# Altium project PropMark.PrjPcb (part 1 of 2)
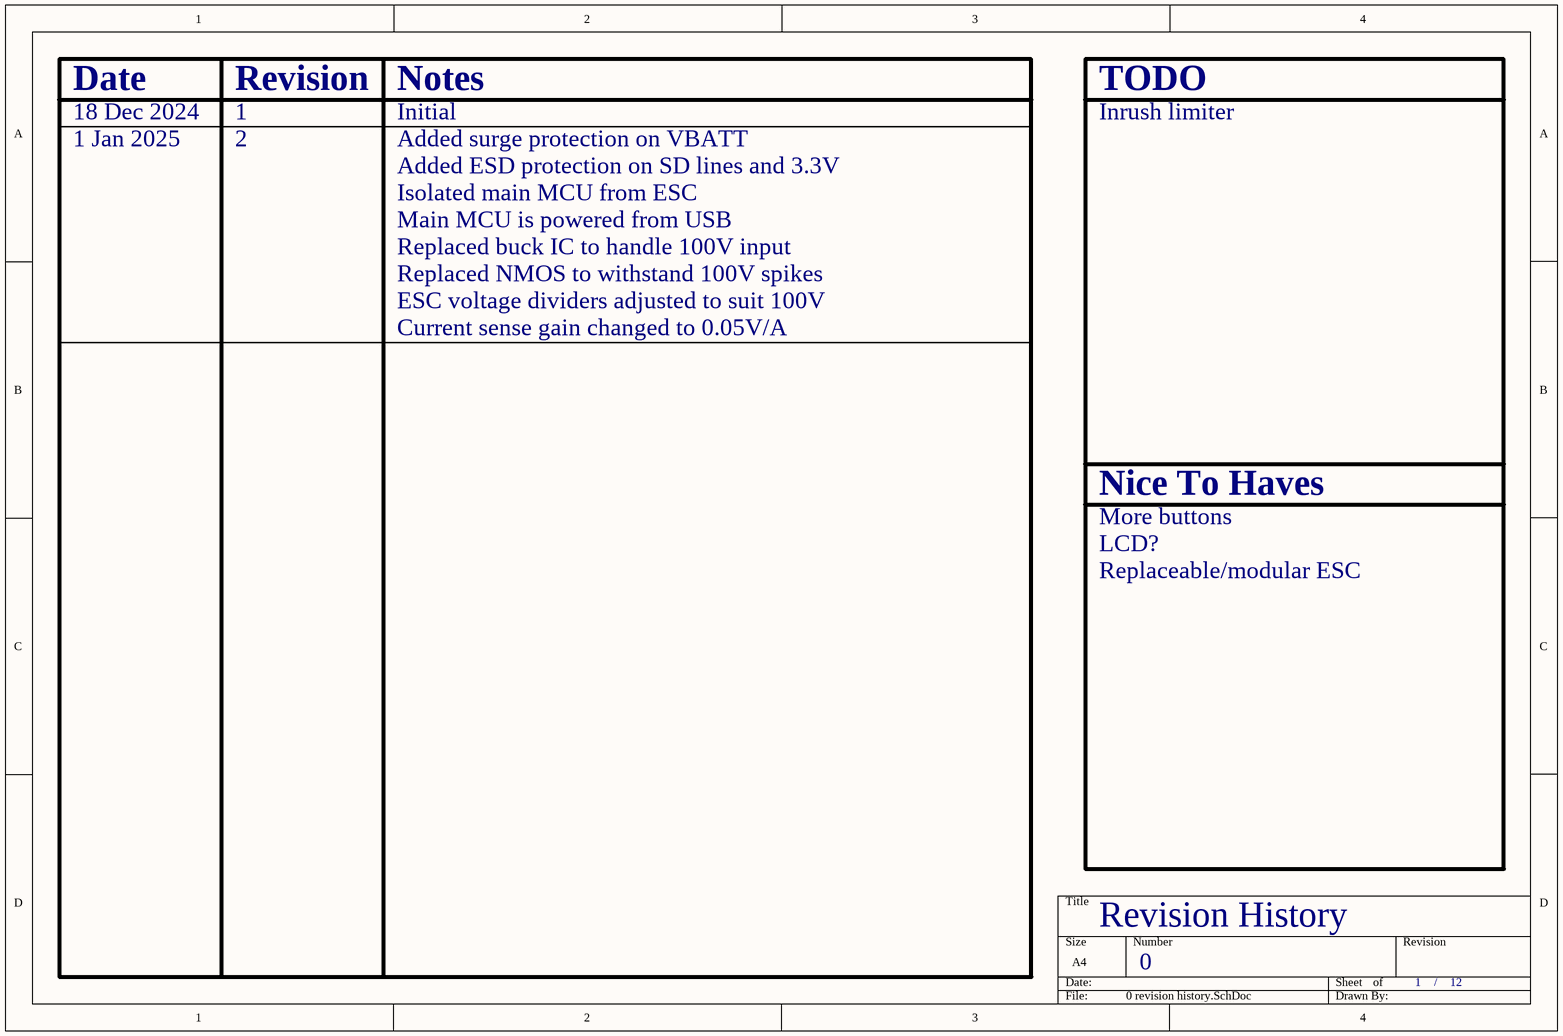
[diagram p0: 0 revision history.SchDoc]
12 sheets, 228 parts. Net scope: hierarchical (ports join the sheet entries above them; power ports are global).
Board files: main.PcbDoc, panel.PcbDoc
Sheets:
  0 revision history.SchDoc
  0 overview.SchDoc
    Power = 1 power.SchDoc
    MCU = 2 main mcu.SchDoc
    Ports = 3 ports.SchDoc
    Memory = 4 memory.SchDoc
    LED = 5 led.SchDoc
    Amplifiers1 = 6 cell amplifier.SchDoc
    Amplifiers2 = 6 cell amplifier.SchDoc
    Amplifiers3 = 6 cell amplifier.SchDoc
    Amplifiers4 = 6 cell amplifier.SchDoc
    Amplifiers5 = 6 cell amplifier.SchDoc
    Amplifiers6 = 6 cell amplifier.SchDoc
    ESC = 7 esc.SchDoc
      H Bridge = 9 h bridge.SchDoc
      Gate Driver = 8 gate driver.SchDoc
    Isolator = 10 isolator.SchDoc
    Isolator = 10 isolator.SchDoc
    Isolator = 10 isolator.SchDoc

## Sheet 0 revision history.SchDoc
size A4; DocumentNumber: 0; SheetNumber: 1; SheetTotal: 12

### Notes on the sheet
- Date
- Revision
- Notes
- TODO
- 18 Dec 2024
- 1 Jan 2025
- 1
- 2
- Initial
- Added surge protection on VBATT
- Added ESD protection on SD lines and 3.3V
- Inrush limiter
- Isolated main MCU from ESC
- Main MCU is powered from USB
- Replaced buck IC to handle 100V input
- Replaced NMOS to withstand 100V spikes
- ESC voltage dividers adjusted to suit 100V
- Current sense gain changed to 0.05V/A
- Nice To Haves
- Replaceable/modular ESC
- More buttons
- LCD?
- Revision History
- /

## Sheet 0 overview.SchDoc
size A4; DocumentNumber: 0; SheetNumber: 2; SheetTotal: 12
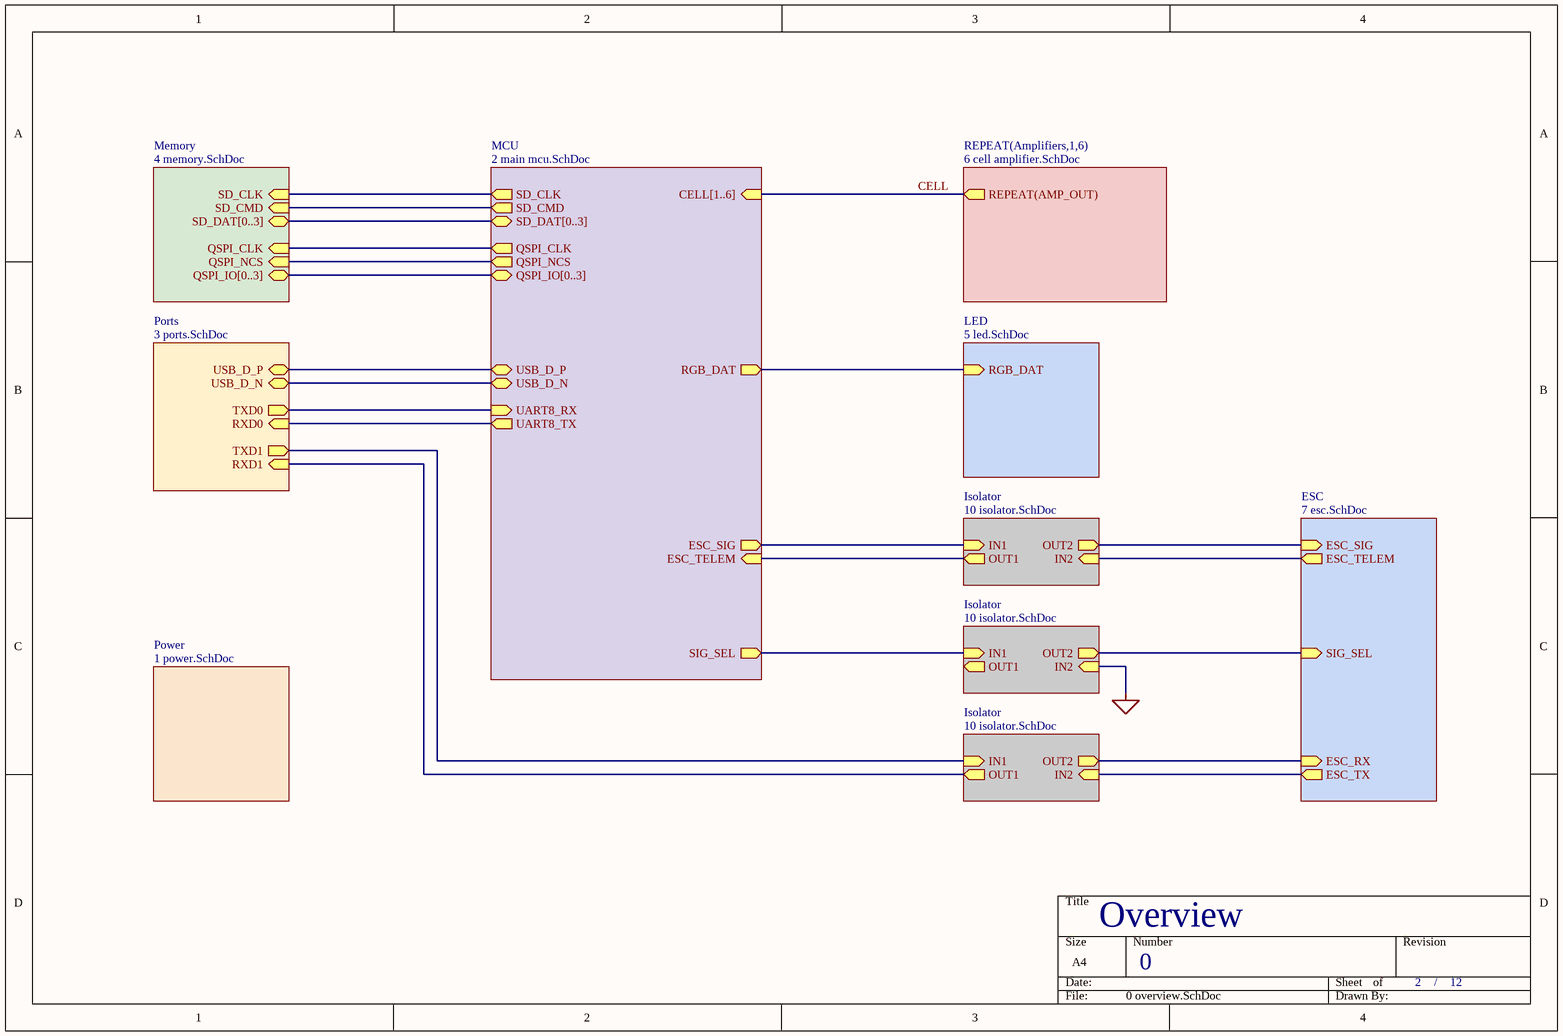
[diagram p1: 0 overview.SchDoc]

### Sub-sheets
ESC = 7 esc.SchDoc: ESC_TELEM (out), ESC_SIG (in), SIG_SEL (in), ESC_TX (out), ESC_RX (in)
Isolator = 10 isolator.SchDoc: OUT1 (out), IN1 (in), OUT2 (out), IN2 (in)
Isolator = 10 isolator.SchDoc: OUT1 (out), IN1 (in), OUT2 (out), IN2 (in)
Isolator = 10 isolator.SchDoc: OUT1 (out), IN1 (in), OUT2 (out), IN2 (in)
LED = 5 led.SchDoc: RGB_DAT (in)
MCU = 2 main mcu.SchDoc: USB_D_P (bidir), USB_D_N (bidir), ESC_SIG (out), SIG_SEL (out), ESC_TELEM (in), SD_CLK (out), SD_CMD (out), SD_DAT[0..3] (bidir), QSPI_IO[0..3] (bidir), QSPI_CLK (out), QSPI_NCS (out), RGB_DAT (out), CELL[1..6] (in), UART8_TX (out), UART8_RX (in)
Memory = 4 memory.SchDoc: SD_CLK (in), SD_CMD (in), SD_DAT[0..3] (bidir), QSPI_IO[0..3] (bidir), QSPI_CLK (in), QSPI_NCS (in)
Ports = 3 ports.SchDoc: USB_D_P (bidir), USB_D_N (bidir), RXD0 (in), TXD0 (out), TXD1 (out), RXD1 (in)
Power = 1 power.SchDoc: no entries
REPEAT(Amplifiers,1,6) = 6 cell amplifier.SchDoc: REPEAT(AMP_OUT) (out)

### Nets
CELL: sheet REPEAT(Amplifiers,1,6)/REPEAT(AMP_OUT)
ESC_RX: sheet ESC/ESC_RX, sheet Isolator/OUT2
ESC_SEL: sheet ESC/SIG_SEL, sheet Isolator/OUT2
ESC_SIG: sheet ESC/ESC_SIG, sheet Isolator/OUT2
ESC_TELEM: sheet ESC/ESC_TELEM, sheet Isolator/IN2
ESC_TX: sheet ESC/ESC_TX, sheet Isolator/IN2
QSPI_CLK: sheet MCU/QSPI_CLK, sheet Memory/QSPI_CLK
QSPI_NCS: sheet MCU/QSPI_NCS, sheet Memory/QSPI_NCS
RGB_DAT: sheet MCU/RGB_DAT, sheet LED/RGB_DAT
RXD0: sheet MCU/UART8_TX, sheet Ports/RXD0
RXD1: sheet Ports/RXD1, sheet Isolator/OUT1
SD_CLK: sheet MCU/SD_CLK, sheet Memory/SD_CLK
SD_CMD: sheet MCU/SD_CMD, sheet Memory/SD_CMD
TXD0: sheet MCU/UART8_RX, sheet Ports/TXD0
TXD1: sheet Ports/TXD1, sheet Isolator/IN1
USB_D_N: sheet MCU/USB_D_N, sheet Ports/USB_D_N
USB_D_P: sheet MCU/USB_D_P, sheet Ports/USB_D_P
NetU201_4: sheet MCU/ESC_SIG, sheet Isolator/IN1
NetU201_5: sheet MCU/SIG_SEL, sheet Isolator/IN1
NetU201_95: sheet MCU/ESC_TELEM, sheet Isolator/OUT1

### Buses and harness runs
bus sheet MCU/QSPI_IO[0..3] = sheet Memory/QSPI_IO[0..3]
bus sheet MCU/SD_DAT[0..3] = sheet Memory/SD_DAT[0..3]

### Notes on the sheet
- Overview
- /

## Sheet 1 power.SchDoc
size A4; DocumentNumber: 1; SheetNumber: 3; SheetTotal: 12
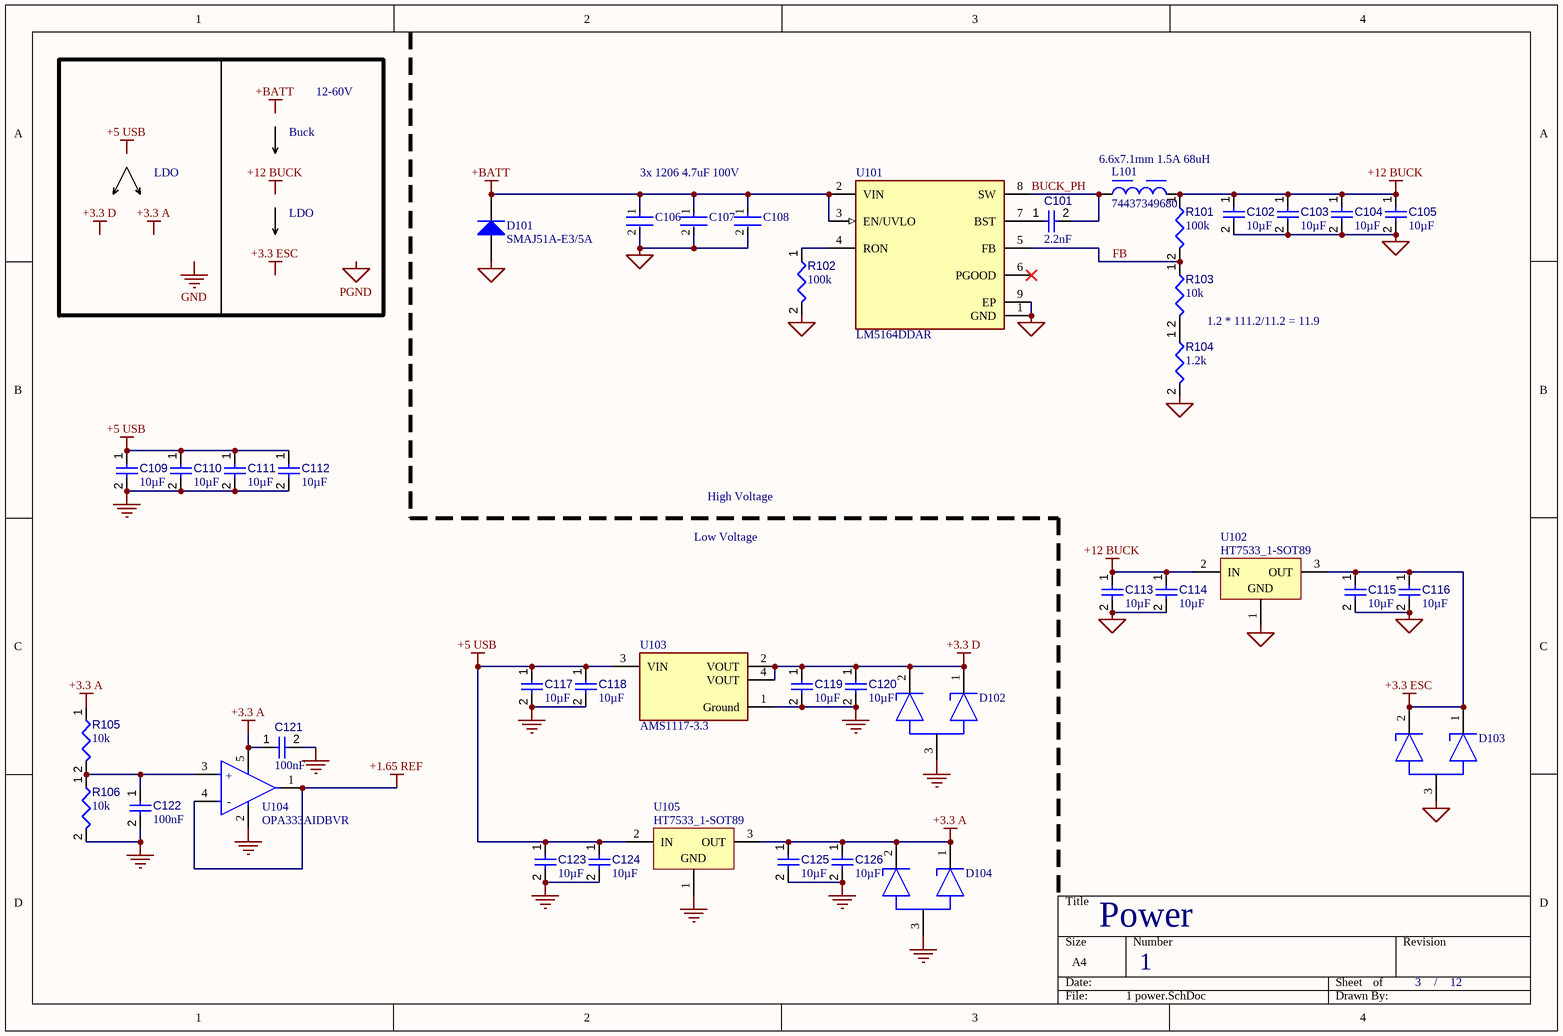
[diagram p2: 1 power.SchDoc]

### Parts
C101  value 2.2nF  [CAPC0402(1005)33_L]  (hidden comment: Capacitor 2.2nF +/-20% 50V 0402)
C102  value 10µF  [CAPC0603(1608)100_L]  (hidden comment: Capacitor 10µF +/-20% 10V 0603)
C103  value 10µF  [CAPC0603(1608)100_L]  (hidden comment: Capacitor 10µF +/-20% 10V 0603)
C104  value 10µF  [CAPC0603(1608)100_L]  (hidden comment: Capacitor 10µF +/-20% 10V 0603)
C105  value 10µF  [CAPC0603(1608)100_L]  (hidden comment: Capacitor 10µF +/-20% 10V 0603)
C106  12061Z475KAT2A  [FP-1206-L_3_2_0_2-W_1_6_0-MFG]  (value not drawn)
C107  12061Z475KAT2A  [FP-1206-L_3_2_0_2-W_1_6_0-MFG]  (value not drawn)
C108  12061Z475KAT2A  [FP-1206-L_3_2_0_2-W_1_6_0-MFG]  (value not drawn)
C109  value 10µF  [CAPC0603(1608)100_L]  (hidden comment: Capacitor 10µF +/-20% 10V 0603)
C110  value 10µF  [CAPC0603(1608)100_L]  (hidden comment: Capacitor 10µF +/-20% 10V 0603)
C111  value 10µF  [CAPC0603(1608)100_L]  (hidden comment: Capacitor 10µF +/-20% 10V 0603)
C112  value 10µF  [CAPC0603(1608)100_L]  (hidden comment: Capacitor 10µF +/-20% 10V 0603)
C113  value 10µF  [CAPC0603(1608)100_L]  (hidden comment: Capacitor 10µF +/-20% 10V 0603)
C114  value 10µF  [CAPC0603(1608)100_L]  (hidden comment: Capacitor 10µF +/-20% 10V 0603)
C115  value 10µF  [CAPC0603(1608)100_L]  (hidden comment: Capacitor 10µF +/-20% 10V 0603)
C116  value 10µF  [CAPC0603(1608)100_L]  (hidden comment: Capacitor 10µF +/-20% 10V 0603)
C117  value 10µF  [CAPC0603(1608)100_L]  (hidden comment: Capacitor 10µF +/-20% 10V 0603)
C118  value 10µF  [CAPC0603(1608)100_L]  (hidden comment: Capacitor 10µF +/-20% 10V 0603)
C119  value 10µF  [CAPC0603(1608)100_L]  (hidden comment: Capacitor 10µF +/-20% 10V 0603)
C120  value 10µF  [CAPC0603(1608)100_L]  (hidden comment: Capacitor 10µF +/-20% 10V 0603)
C121  value 100nF  [CAPC0402(1005)60_L]  (hidden comment: Capacitor 100nF +/-20% 25V 0402)
C122  value 100nF  [CAPC0402(1005)60_L]  (hidden comment: Capacitor 100nF +/-20% 25V 0402)
C123  value 10µF  [CAPC0603(1608)100_L]  (hidden comment: Capacitor 10µF +/-20% 10V 0603)
C124  value 10µF  [CAPC0603(1608)100_L]  (hidden comment: Capacitor 10µF +/-20% 10V 0603)
C125  value 10µF  [CAPC0603(1608)100_L]  (hidden comment: Capacitor 10µF +/-20% 10V 0603)
C126  value 10µF  [CAPC0603(1608)100_L]  (hidden comment: Capacitor 10µF +/-20% 10V 0603)
D101  SMAJ51A-E3/5A  [VISH-DO-214AC-2_N]
D102  PESD3V3S2UT,215  [FP-SOT23-IPC_A]  (value not drawn)
D103  PESD3V3S2UT,215  [FP-SOT23-IPC_A]  (value not drawn)
D104  PESD3V3S2UT,215  [FP-SOT23-IPC_A]  (value not drawn)
L101  74437349680  [WE-LHMI_7050]
R101  value 100k  [RESC0402(1005)_L]  (hidden comment: Resistor 100K +/-1 % 0402 63 mW)
R102  value 100k  [RESC0402(1005)_L]  (hidden comment: Resistor 100K +/-1 % 0402 63 mW)
R103  value 10k  [RESC0402(1005)_L]  (hidden comment: Resistor 10K  +/-1 % 0402 63 mW)
R104  value 1.2k  [RESC0402(1005)_L]  (hidden comment: Resistor 1K2 +/-1 % 0402 63 mW)
R105  value 10k  [RESC0402(1005)_L]  (hidden comment: Resistor 10K  +/-1 % 0402 63 mW)
R106  value 10k  [RESC0402(1005)_L]  (hidden comment: Resistor 10K  +/-1 % 0402 63 mW)
U101  LM5164DDAR  [FP-DDA0008E-MFG]
U102  HT7533_1-SOT89  [SOT89_L]
U103  AMS1117-3.3  [FP-AMS1117-IPC_C]
U104  OPA333AIDBVR  [FP-DBV0005A-MFG]
U105  HT7533_1-SOT89  [SOT89_L]

### Nets
+1.65 REF: U104.1(OUT) U104.4(-IN)
+3.3 A: C121.1 C125.1 C126.1 D104.1 D104.2 R105.1 U104.5(V+) U105.3(OUT)
+3.3 D: C119.1 C120.1 D102.1 D102.2 U103.2(VOUT) U103.4(VOUT)
+3.3 ESC: C115.1 C116.1 D103.1 D103.2 U102.3(OUT)
+5 USB: C109.1 C110.1 C111.1 C112.1 C117.1 C118.1 C123.1 C124.1 U103.3(VIN) U105.2(IN)
+12 BUCK: C102.1 C103.1 C104.1 C105.1 C113.1 C114.1 L101.2 R101.1 U102.2(IN)
+BATT: C106.1 C107.1 C108.1 D101.1(K) U101.2(VIN) U101.3(EN/UVLO)
GND: C109.2 C110.2 C111.2 C112.2 C117.2 C118.2 C119.2 C120.2 C121.2 C122.2 C123.2 C124.2 C125.2 C126.2 D102.3 D104.3 R106.2 U103.1(Ground) U104.2(V-) U105.1(GND)
PGND: C102.2 C103.2 C104.2 C105.2 C106.2 C107.2 C108.2 C113.2 C114.2 C115.2 C116.2 D101.2(A) D103.3 R102.2 R104.2 U101.1(GND) U101.9(EP) U102.1(GND)
BUCK_PH: C101.2 L101.1 U101.8(SW)
FB: R101.2 R103.1 U101.5(FB)
NetC101_1: C101.1 U101.7(BST)
NetC122_1: C122.1 R105.2 R106.1 U104.3(+IN)
NetR102_1: R102.1 U101.4(RON)
NetR103_2: R103.2 R104.1

Not connected (* = marked no-connect by the designer): U101 6(PGOOD)*

### Notes on the sheet
- 12-60V
- LDO
- Buck
- 3x 1206 4.7uF 100V
- 6.6x7.1mm 1.5A 68uH
- 1.2 * 111.2/11.2 = 11.9
- High Voltage
- Low Voltage
- Power
- /
- Labels drawn without touching a wire or pin: +3.3 A, +3.3 D, +3.3 ESC, +5 USB, +12 BUCK, +BATT, GND, PGND
- (in symbol CMP-0272-00862-4) +; -

### Library data of the parts
C101 = CMP-001-00066-3: Chip Capacitor, 1nF +/-20%, 50V, 0402, Thickness 0.33 mm; Tolerance: 10%; Case/Package: 0402; Pins: 2; Min Operating Temperature: -55°C; Max Operating Temperature: 85°C; Voltage Rating: 50V; Mounting Technology: SMT
C102-C105 C109-C120 C123-C126 = CMP-001-00075-4: Chip Capacitor, 10µF +/-20%, 10V, 0603, Thickness 1 mm; Tolerance: 10%; Voltage Rating: 10V; Max Operating Temperature: 85°C; Pins: 2; Case/Package: 0603; Mounting Technology: SMT; Min Operating Temperature: -55°C
C106-C108 = CMP-2000-05019-2: CAP CER 4.7UF 100V X7S 1206; Tolerance: 10%; Thickness: 0.075inch; Max Operating Temperature: 125°C; Termination: SMD/SMT; Dielectric: X7S; Case Code (Metric): 3216; Case/Package: 1206; Height: 0.5mm; Mount: Surface Mount; Voltage Rating (DC): 100V; Min Operating Temperature: -55°C; Package Quantity: 1; Length: 3.2mm; Voltage Rating: 100V; Lead Free: Lead Free; RoHS Compliant: Yes; Packaging: Tape and Reel; Weight: 0.000571oz; Capacitance: 4.7uF; REACH SVHC: No SVHC; Case Code (Imperial): 1206; Width: 0.063inch; Depth: 1.6mm
C121 C122 = CMP-001-00065-4: Chip Capacitor, 100nF +/-20%, 25V, 0402, Thickness 0.6 mm; Tolerance: 10%; Max Operating Temperature: 85°C; Min Operating Temperature: -55°C; Pins: 2; Voltage Rating: 25V; Mounting Technology: SMT; Case/Package: 0402
D101 = CMP-0544-00031-2: Transient Voltage Suppressor, 6.40 to 231 V, 51 V Stand-off Voltage, Uni-Directional, -55 to 155 degC, 2-pin DO-214AC, Pb-Free, Tape and Reel; Manufacturer: Vishay Semiconductor; IFSM: 40 A; ID (uA): 1; VBR Uni-Directional (V): 6.4 to 231; PPPM (W): 400, 300; VWM (V): 51; ComponentLink3Description: Package Specification; PackageDescription: 2-Pin DO-214AC (SMA), Body 4.245 x 2.665 mm; ComponentLink1Description: Manufacturer URL; ComponentLink2Description: Datasheet; ComponentLink3URL: http://www.vishay.com/docs/88390/smaj50a.pdf; DatasheetVersion: 12/8/2013; ComponentLink2URL: http://www.vishay.com/docs/88390/smaj50a.pdf; PackageReference: DO-214AC-2; RoHS: TRUE; Operating Junction and Storage Temperature Range: -55 to 150 degC; ComponentLink1URL: http://www.vishay.com/; PartNumber: SMAJ51A-E3/5A; Packing: Tape and Reel; Mounting Technology: Surface Mount
D102-D104 = CMP-14432-000008-1: TVS DIODE 3.3VWM 20VC TO236AB; RoHS Compliant: Yes
L101 = CMP-1353-00069-6: NexarPartId: 65255814; Inductance Tolerance: 20%; Saturation Current: 1.45A; Inductance: 68µH; DC Resistance (DCR): 386mΩ; Ambient Temperature Range High: 85°C; Ambient Temperature Range Low: -40°C; RoHS: Compliant; Length: 7.3mm; Min Operating Temperature: -40°C; Max Operating Temperature: 125°C; Height: 4.8mm; Width: 6.6mm
R101 R102 = CMP-009-00168-3: Chip Resistor, 100 kOhms, +/-1 %, 63 mW, -55 to 155 degC, 0402; Tolerance: 1%; Power: 63mW; Max Operating Temperature: 155°C; Min Operating Temperature: -55°C; Pins: 2; Case/Package: 0402
R103 R105 R106 = CMP-009-00149-3: Chip Resistor, 10 kOhms, +/-1 %, 63 mW, -55 to 125 degC, 0402; Power: 63mW; Tolerance: 1%; Min Operating Temperature: -55°C; Case/Package: 0402; Max Operating Temperature: 155°C; Pins: 2
R104 = CMP-009-00157-3: Chip Resistor, 1.2 kOhms, +/-1 %, 63 mW, -55 to 155 degC, 0402; Tolerance: 1%; Power: 63mW; Case/Package: 0402; Pins: 2; Min Operating Temperature: -55°C; Max Operating Temperature: 155°C
U101 = CMP-04918-000011-1: POWER MANAGEMENT; Manufacturer: Texas Instruments; Standoff Height: 0mm; Max Supply Voltage: 100V; Output Voltage: 1.2-90V; Max Duty Cycle: 99%; Nominal Supply Current: 600uA; Output Current: 1A; Min Supply Voltage: 6V; Output Type: AdjustableProgrammable; Max Junction Temp: +150°C; Number Of Outputs: 1; Switching Frequency: 1000kHz; Switching Topology: Buck; Temperature: -40°C to +150°C; Device Class L1: Integrated Circuits (ICs); Automotive: No; Lead Free: Yes; Package: DDA0008E; Device Class L3: Voltage Regulators - Switching; Manufacturer Part Number: LM5164DDAR; Device Class L2: Power Management ICs; RoHS: TRUE; Mouser Description: 6-V to 100-V input, 1-A synchronous buck DC-DC converter with ultra-low IQ 8-SO PowerPAD -40 to 150; Temperature Range Low: -40°C; ComponentLink2Description: Datasheet; Temperature Range High: +150°C; ComponentLink2URL: http://www.ti.com/lit/ds/symlink/lm5164.pdf; Digikey Description: POWER MANAGEMENT; Category: IC; Octopart: https://octopart.com/lm5164ddar-texas+instruments-96785744
U102 U105 = CMP-0204-00101-1: 100mA Low Power LDO, Output Voltage 3.3V, SOT89 Pkg; DatasheetVersion: Rev1.80, Mar-2010; PackageDescription: 3-Pin SOT-89 Package 1.5 mm Pitch, 4.1 mm Lead Span; PackageReference: SOT89; PackageVersion: May-2010; Code_IPC: SOT89
U103 = CMP-209535-000001-1: LDO Voltage Regulators 1A, 3.3V; Manufacturer: Advanced Monolithic Systems; Dropout Voltage: 1.1V; Output Type: Fixed; Nominal Supply Current: 5mA; Max Power Dissipation: 1.2W; Max Supply Voltage: 15V; Number Of Outputs: 1; Standoff Height: 0.64mm; Max Junction Temp: +125°C; Height: 1.8mm; Package: AMS1117; Device Class L2: Power Management ICs; ComponentLink2Description: Datasheet; ComponentLink2URL: http://www.advanced-monolithic.com/pdf/ds1117.pdf; Category: IC; RoHS: TRUE; Automotive: No; Device Class L1: Integrated Circuits (ICs); Output Current: 1A; Device Class L3: Voltage Regulators - Linear; Temperature: -40°C to +125°C; Output Voltage: 3.3V; Manufacturer Part Number: AMS1117-3.3; Temperature Range Low: -40°C; Octopart: https://octopart.com/ams1117-3.3-advanced+monolithic+systems-25899300; Lead Free: Yes; Ipc Land Pattern Name: SOT229P700X180-4; Temperature Range High: +125°C; JLCPCB Part #: C6186
U104 = CMP-0272-00862-4: IC OPAMP ZER-DRIFT 1CIRC SOT23-5; Number of Elements: 1; Common Mode Rejection Ratio: 106dB; Max Supply Voltage: 5.5V; Min Supply Voltage: 1.8V; Max I/O Voltage: 10uV; Output Current per Channel: 5mA; Max Dual Supply Voltage: 2.75V; Operating Supply Current: 17uA; Nominal Supply Current: 25uA; Bandwidth: 350kHz; Min Dual Supply Voltage: 900mV; Power Supply Rejection Ratio (PSRR): 120dB; Voltage Gain: 130dB; Input Bias Current: 200pA; Slew Rate: 0.16V/µs; Number of Channels: 1; Max Operating Temperature: 125°C; REACH SVHC: No SVHC; Number of Amplifiers: 1; Input Offset Voltage (Vos): 10uV; Radiation Hardening: No; Lead Free: Lead Free; Operating Supply Voltage: 2.75V; Min Operating Temperature: -40°C; Contact Plating: Gold; Number of Pins: 5; Output Current: 5mA; Packaging: Tape and Reel; Unity Gain Bandwidth Product: 350kHz; Number of Circuits: 1; Gain Bandwidth Product: 350kHz; Case/Package: SOT-23-5; Package Quantity: 1

## Sheet 2 main mcu.SchDoc
size A4; DocumentNumber: 2; SheetNumber: 4; SheetTotal: 12
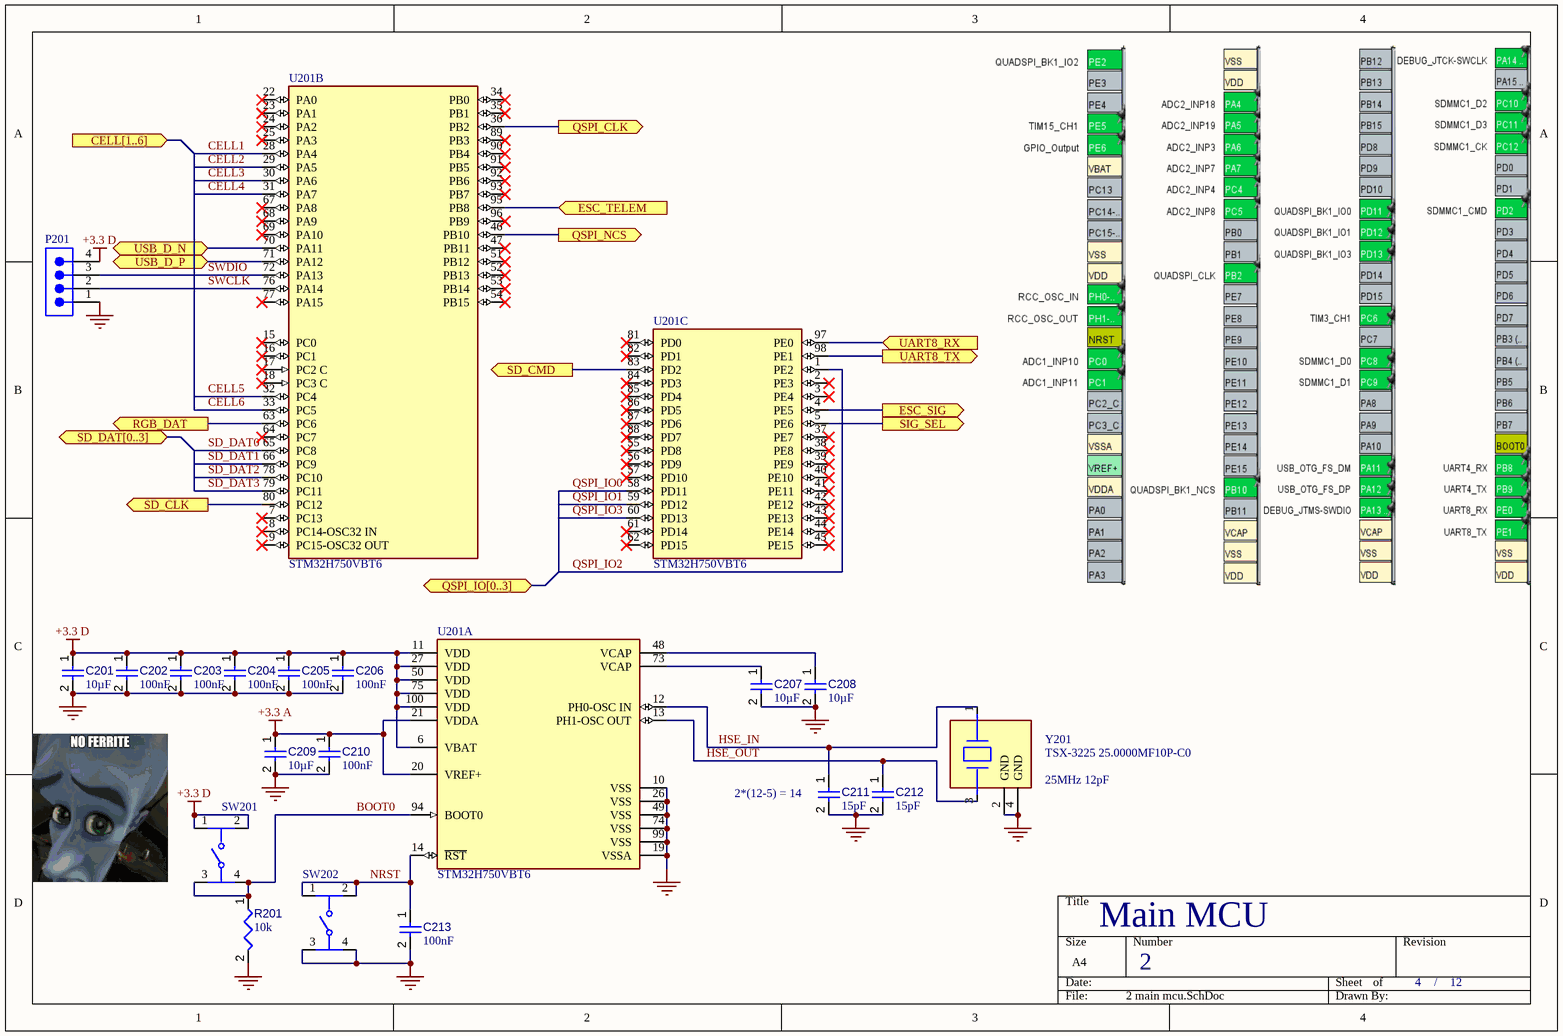
[diagram p3: 2 main mcu.SchDoc]

### Parts
C201  value 10µF  [CAPC0603(1608)100_L]  (hidden comment: Capacitor 10µF +/-20% 10V 0603)
C202  value 100nF  [CAPC0402(1005)60_L]  (hidden comment: Capacitor 100nF +/-20% 25V 0402)
C203  value 100nF  [CAPC0402(1005)60_L]  (hidden comment: Capacitor 100nF +/-20% 25V 0402)
C204  value 100nF  [CAPC0402(1005)60_L]  (hidden comment: Capacitor 100nF +/-20% 25V 0402)
C205  value 100nF  [CAPC0402(1005)60_L]  (hidden comment: Capacitor 100nF +/-20% 25V 0402)
C206  value 100nF  [CAPC0402(1005)60_L]  (hidden comment: Capacitor 100nF +/-20% 25V 0402)
C207  value 10µF  [CAPC0603(1608)100_L]  (hidden comment: Capacitor 10µF +/-20% 10V 0603)
C208  value 10µF  [CAPC0603(1608)100_L]  (hidden comment: Capacitor 10µF +/-20% 10V 0603)
C209  value 10µF  [CAPC0603(1608)100_L]  (hidden comment: Capacitor 10µF +/-20% 10V 0603)
C210  value 100nF  [CAPC0402(1005)60_L]  (hidden comment: Capacitor 100nF +/-20% 25V 0402)
C211  value 15pF  [CAPC0402(1005)60_L]  (hidden comment: Capacitor 15pF +/-20% 50V 0402)
C212  value 15pF  [CAPC0402(1005)60_L]  (hidden comment: Capacitor 15pF +/-20% 50V 0402)
C213  value 100nF  [CAPC0402(1005)60_L]  (hidden comment: Capacitor 100nF +/-20% 25V 0402)
P201  61300411121  [61300411121]  (value not drawn)
R201  value 10k  [RESC0402(1005)_L]  (hidden comment: Resistor 10K  +/-1 % 0402 63 mW)
SW201  PTS810SJM250SMTRLFS  [FP-PTS810SJM250SMTRLFS-MFG]  (value not drawn)
SW202  PTS810SJM250SMTRLFS  [FP-PTS810SJM250SMTRLFS-MFG]  (value not drawn)
U201  STM32H750VBT6  [FP-LQFP100-1L-MFG]  (parts A,B,C of 3)
Y201  TSX-3225 25.0000MF10P-C0  [FP-TSX-3225-MFG]

### Ports
CELL[1..6] (in), ESC_SIG (out), ESC_TELEM (in), QSPI_CLK (out), QSPI_IO[0..3] (bidir), QSPI_NCS (out), RGB_DAT (out), SD_CLK (out), SD_CMD (out), SD_DAT[0..3] (bidir), SIG_SEL (out), UART8_RX (in), UART8_TX (out), USB_D_N (bidir), USB_D_P (bidir)

### Nets
+3.3 A: C209.1 C210.1 U201.20(VREF+) U201.21(VDDA)
+3.3 D: C201.1 C202.1 C203.1 C204.1 C205.1 C206.1 P201.4 SW201.1 SW201.2 U201.6(VBAT) U201.11(VDD) U201.27(VDD) U201.50(VDD) U201.75(VDD) U201.100(VDD)
GND: C201.2 C202.2 C203.2 C204.2 C205.2 C206.2 C207.2 C208.2 C209.2 C210.2 C211.2 C212.2 C213.2 P201.1 R201.2 SW202.3 SW202.4 U201.10(VSS) U201.19(VSSA) U201.26(VSS) U201.49(VSS) U201.74(VSS) U201.99(VSS) Y201.2(GND) Y201.4(GND)
BOOT0: R201.1 SW201.3 SW201.4 U201.94(BOOT0)
CELL1: U201.28(PA4)
CELL2: U201.29(PA5)
CELL3: U201.30(PA6)
CELL4: U201.31(PA7)
CELL5: U201.32(PC4)
CELL6: U201.33(PC5)
HSE_IN: C211.1 U201.12(PH0-OSC_IN) Y201.1
HSE_OUT: C212.1 U201.13(PH1-OSC_OUT) Y201.3
NRST: C213.1 SW202.1 SW202.2 U201.14(~{RST})
QSPI_CLK: U201.36(PB2) ; port QSPI_CLK
QSPI_IO0: U201.58(PD11)
QSPI_IO1: U201.59(PD12)
QSPI_IO2: U201.1(PE2)
QSPI_IO3: U201.60(PD13)
QSPI_NCS: U201.46(PB10) ; port QSPI_NCS
RGB_DAT: U201.63(PC6) ; port RGB_DAT
RXD0: U201.98(PE1) ; port UART8_TX
SD_CLK: U201.80(PC12) ; port SD_CLK
SD_CMD: U201.83(PD2) ; port SD_CMD
SD_DAT0: U201.65(PC8)
SD_DAT1: U201.66(PC9)
SD_DAT2: U201.78(PC10)
SD_DAT3: U201.79(PC11)
SWCLK: P201.2 U201.76(PA14)
SWDIO: P201.3 U201.72(PA13)
TXD0: U201.97(PE0) ; port UART8_RX
USB_D_N: U201.70(PA11) ; port USB_D_N
USB_D_P: U201.71(PA12) ; port USB_D_P
NetC207_1: C207.1 U201.73(VCAP)
NetC208_1: C208.1 U201.48(VCAP)
NetU201_4: U201.4(PE5) ; port ESC_SIG
NetU201_5: U201.5(PE6) ; port SIG_SEL
NetU201_95: U201.95(PB8) ; port ESC_TELEM

Not connected (* = marked no-connect by the designer): U201 2(PE3)* 3(PE4)* 7(PC13)* 8(PC14-OSC32_IN)* 9(PC15-OSC32_OUT)* 15(PC0)* 16(PC1)* 17(PC2_C)* 18(PC3_C)* 22(PA0)* 23(PA1)* 24(PA2)* 25(PA3)* 34(PB0)* 35(PB1)* 37(PE7)* 38(PE8)* 39(PE9)* 40(PE10)* 41(PE11)* 42(PE12)* 43(PE13)* 44(PE14)* 45(PE15)* 47(PB11)* 51(PB12)* 52(PB13)* 53(PB14)* 54(PB15)* 55(PD8)* 56(PD9)* 57(PD10)* 61(PD14)* 62(PD15)* 64(PC7)* 67(PA8)* 68(PA9)* 69(PA10)* 77(PA15)* 81(PD0)* 82(PD1)* 84(PD3)* 85(PD4)* 86(PD5)* 87(PD6)* 88(PD7)* 89(PB3)* 90(PB4)* 91(PB5)* 92(PB6)* 93(PB7)* 96(PB9)*

### Notes on the sheet
- (near Y201) 25MHz 12pF
- (near C211) 2*(12-5) = 14
- Main MCU
- /

### Library data of the parts
C201 C207-C209 = CMP-001-00075-4: as C102 on sheet 1 power; Voltage Rating: 10V; Max Operating Temperature: 85°C; Pins: 2; Case/Package: 0603; Mounting Technology: SMT; Min Operating Temperature: -55°C
C202-C206 C210 C213 = CMP-001-00065-4: as C121 on sheet 1 power; Max Operating Temperature: 85°C; Min Operating Temperature: -55°C; Pins: 2; Voltage Rating: 25V; Mounting Technology: SMT; Case/Package: 0402
C211 C212 = CMP-001-00069-3: Chip Capacitor, 15pF +/-20%, 50V, 0402, Thickness 0.6 mm; Tolerance: 5%; Max Operating Temperature: 85°C; Pins: 2; Case/Package: 0402; Voltage Rating: 50V; Min Operating Temperature: -55°C; Mounting Technology: SMT; JLCPCB Part #: C1548
P201 = CMP-1502-01064-3: NexarPartId: 32855522; Operating Supply Voltage: 250V; Pitch: 2.54mm; Contact Resistance: 20mΩ; Number of Positions: 4; Current Rating: 3A; Connector Type: Male Pin; Gender: Male; Contact Plating: Gold; Height: 8.89mm; Lead Pitch: 2.54mm; Lead Free: Lead Free; Contact Mating Length: 5.9944mm; Number of Rows: 1; Termination: Solder; Packaging: Bulk; REACH SVHC: Unknown; Min Operating Temperature: -40°C; RoHS: Compliant; Number of Contacts: 4; Voltage Rating: 250V; Color: Black; Max Operating Temperature: 105°C; Contact Material: Copper; Mount: Through Hole; Orientation: Vertical; Number of Pins: 4
R201 = CMP-009-00149-3: as R103 on sheet 1 power; Min Operating Temperature: -55°C; Case/Package: 0402; Max Operating Temperature: 155°C; Pins: 2
SW201 SW202 = CMP-10040-000001-2: SWITCH TACTILE SPST-NO 0.05A 16V; Throw Configuration: SPST; Operating Force: 160gf; Actuator Type: Standard; Switch Travel: 0.15mm; Switch Function: Off-Mom; Max Current Rating: 50mA; Mechanical Life: 150000Cycles; Illumination Type: Non-Illuminated; Package Quantity: 2900; Depth: 4.6mm; Mount: Surface Mount; Packaging: Tape and Reel; Length: 3.2mm; RoHS Compliant: Yes; Case/Package: SMD/SMT; Voltage Rating (DC): 16V; Min Operating Temperature: -40°C; Termination: J-Bend; Lead Free: Lead Free; Contact Plating: Silver; Orientation: Straight; Max Operating Temperature: 85°C; Current Rating: 50mA; Color: Black
U201 = CMP-12105-000017-1: IC MCU 32BIT 128KB FLASH 100LQFP; Manufacturer: STMicroelectronics; Number Of Uart Channels: 9; Number Of I/Os: 82; Max Junction Temp: +125°C; Data Bus Width: 32bits; Ram Size: 1MBytes; Min Supply Voltage: 1.62V; Number Of Spi Channels: 6; Number Of Adc Channels: 36; Max Supply Voltage: 3.6V; Standoff Height: 0.05mm; Interface: I2C,SPI,UART,USART,CAN,USB,LIN,IrDA,Ethernet,I2S,Other; Number Of A/D Converters: 3; Number Of I2C Channels: 4; Memory Size: 128KBytes; Frequency: 480MHz; Number Of Timers/Counters: 20; Number Of Ethernet Channels: 1; Core Architecture: ARM Cortex-M7; Number Of Usb Channels: 2; Number Of Pwm Channels: 42; Ambient Temperature Range High: +85°C; Temperature: -40°C to +125°C; ComponentLink2URL: https://www.st.com/resource/en/datasheet/stm32h750vb.pdf; Device Class L2: Embedded Processors and Controllers; Temperature Range Low: -40°C; Octopart: https://octopart.com/stm32h750vbt6-stmicroelectronics-94048547; Category: IC; Manufacturer Part Number: STM32H750VBT6; Height: 1.6mm; Lead Free: Yes; Device Class L1: Integrated Circuits (ICs); Digikey Description: IC MCU 32BIT 128KB FLASH 100LQFP; RoHS: TRUE; Ambient Temperature Range Low: -40°C; Device Class L3: Microcontrollers; ComponentLink2Description: Datasheet; Mouser Description: MCU 32-Bit STM32H750VB ARM Cortex M7 RISC 128KB Flash 1.8V/2.5V/3.3V 100-Pin LQFP Tray; Number Of Cores: 1; Automotive: No; Memory Type: FLASH; Package: LQFP100-1L; Temperature Range High: +125°C
Y201 = CMP-36405-000019-1: CRYSTAL 25.0000MHZ 18PF SMD; ESR (Equivalent Series Resistance): 40R; Frequency Stability: 10ppm; Frequency: 25MHz; Max Operating Temperature: 85°C; Length: 3.2mm; Packaging: Tape and Reel; Min Operating Temperature: -20°C; Depth: 2.5mm; Case/Package: SMD/SMT; Load Capacitance: 18pF; Number of Pins: 4

## Sheet 3 ports.SchDoc
size A4; DocumentNumber: 3; SheetNumber: 5; SheetTotal: 12
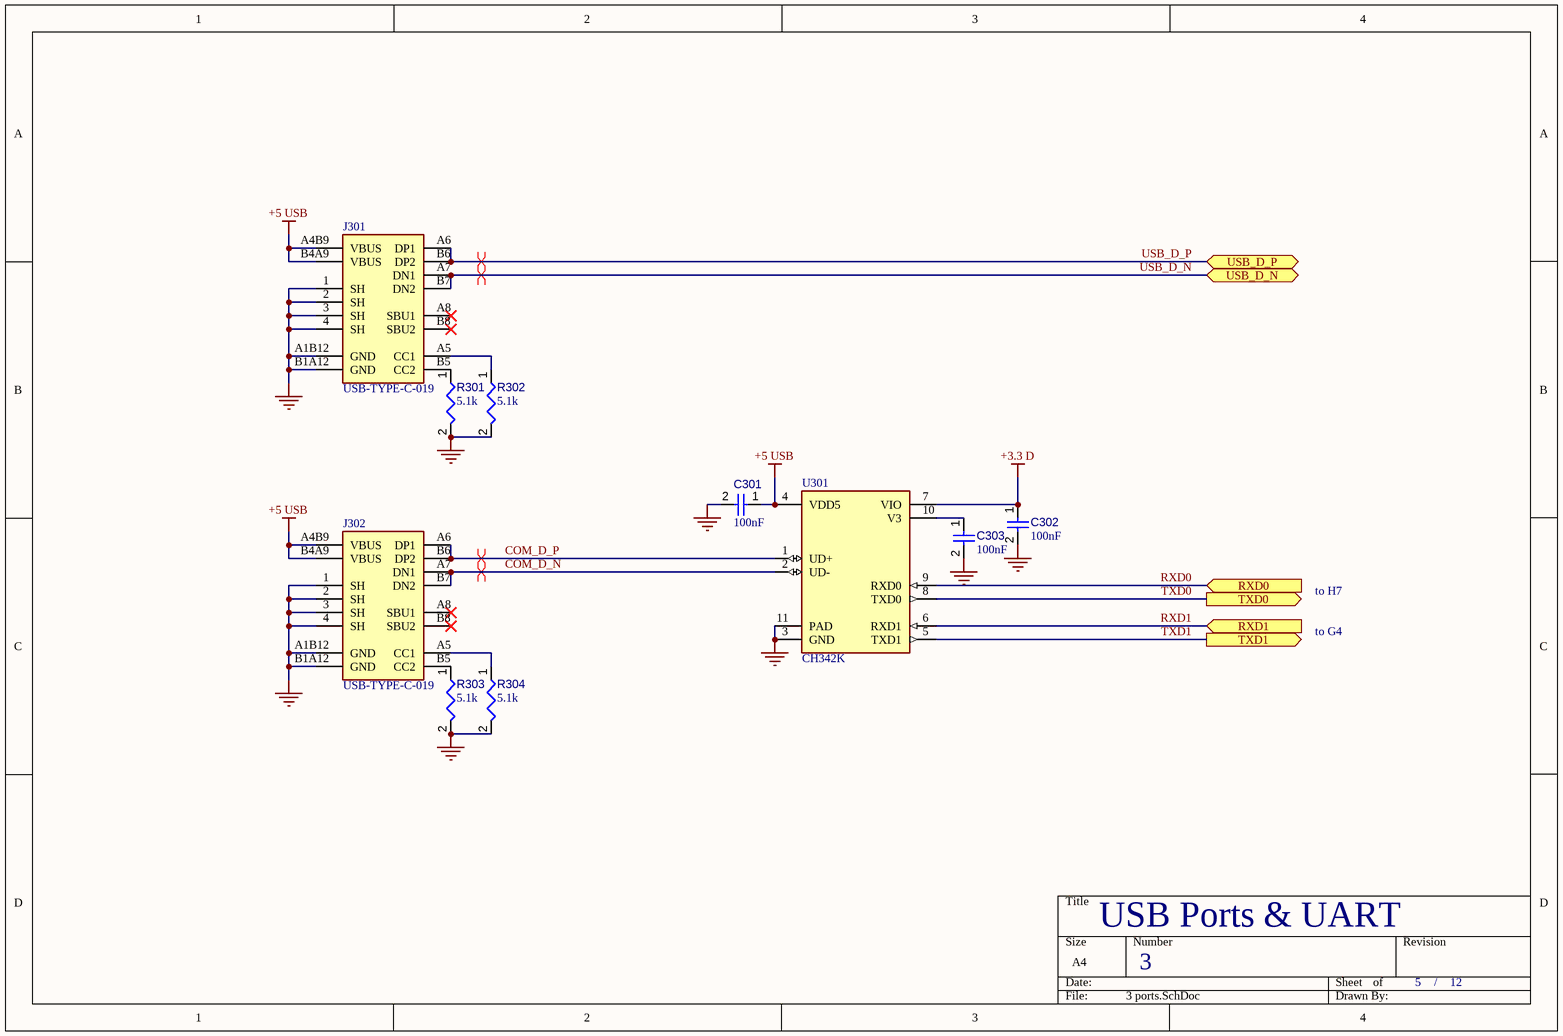
[diagram p4: 3 ports.SchDoc]

### Parts
C301  value 100nF  [CAPC0402(1005)60_L]  (hidden comment: Capacitor 100nF +/-20% 25V 0402)
C302  value 100nF  [CAPC0402(1005)60_L]  (hidden comment: Capacitor 100nF +/-20% 25V 0402)
C303  value 100nF  [CAPC0402(1005)60_L]  (hidden comment: Capacitor 100nF +/-20% 25V 0402)
J301  USB-TYPE-C-019  [USB-TYPE-C-12+4P]
J302  USB-TYPE-C-019  [USB-TYPE-C-12+4P]
R301  value 5.1k  [RESC0402(1005)_L]  (hidden comment: Resistor 5K1  +/-1 % 0402 63 mW)
R302  value 5.1k  [RESC0402(1005)_L]  (hidden comment: Resistor 5K1  +/-1 % 0402 63 mW)
R303  value 5.1k  [RESC0402(1005)_L]  (hidden comment: Resistor 5K1  +/-1 % 0402 63 mW)
R304  value 5.1k  [RESC0402(1005)_L]  (hidden comment: Resistor 5K1  +/-1 % 0402 63 mW)
U301  CH342K  [SSOP-10_L5.0-W3.9-P1.00-LS6.0-BL-EP]

### Ports
RXD0 (in), RXD1 (in), TXD0 (out), TXD1 (out), USB_D_N (bidir), USB_D_P (bidir)

### Nets
+3.3 D: C302.1 U301.7(VIO)
+5 USB: C301.1 J301.A4B9(VBUS) J301.B4A9(VBUS) J302.A4B9(VBUS) J302.B4A9(VBUS) U301.4(VDD5)
GND: C301.2 C302.2 C303.2 J301.1(SH) J301.2(SH) J301.3(SH) J301.4(SH) J301.A1B12(GND) J301.B1A12(GND) J302.1(SH) J302.2(SH) J302.3(SH) J302.4(SH) J302.A1B12(GND) J302.B1A12(GND) R301.2 R302.2 R303.2 R304.2 U301.3(GND) U301.11(PAD)
COM_D_N: J302.A7(DN1) J302.B7(DN2) U301.2(UD-)
COM_D_P: J302.A6(DP1) J302.B6(DP2) U301.1(UD+)
RXD0: U301.9(RXD0) ; port RXD0
RXD1: U301.6(RXD1) ; port RXD1
TXD0: U301.8(TXD0) ; port TXD0
TXD1: U301.5(TXD1) ; port TXD1
USB_D_N: J301.A7(DN1) J301.B7(DN2) ; port USB_D_N
USB_D_P: J301.A6(DP1) J301.B6(DP2) ; port USB_D_P
NetC303_1: C303.1 U301.10(V3)
NetJ301_A5: J301.A5(CC1) R302.1
NetJ301_B5: J301.B5(CC2) R301.1
NetJ302_A5: J302.A5(CC1) R304.1
NetJ302_B5: J302.B5(CC2) R303.1

Not connected (* = marked no-connect by the designer): J301 A8(SBU1)* B8(SBU2)*; J302 A8(SBU1)* B8(SBU2)*

### Layout directives
differential pair: COM_D_N, COM_D_P, USB_D_N, USB_D_P

### Notes on the sheet
- to H7
- to G4
- USB Ports & UART
- /

### Library data of the parts
C301-C303 = CMP-001-00065-4: as C121 on sheet 1 power; Max Operating Temperature: 85°C; Min Operating Temperature: -55°C; Pins: 2; Voltage Rating: 25V; Mounting Technology: SMT; Case/Package: 0402
J301 J302 = USB-TYPE-C-019: Connector Type:Type-C Standard:- Gender:Female Number of Contacts:16 Number of Ports:1 Mounting Style:Surface Mount Current Rating - Power (Max):3A Operating Temperature Range:-25℃~+85℃ Operating Temperature Range:-25℃~+85℃; Manufacturer: DEALON(德艺隆); Add into BOM: yes; Connector Type: Type-C; Gender: Female; Number of Contacts: 16; Number of Ports: 1; Current Rating - Power (Max): 3A; Symbol: USB-TYPE-C-019; Device: USB-TYPE-C-019; LCSC Part Name: Type-C 母座 卧贴; Supplier Part: C2927039; Manufacturer Part: USB-TYPE-C-019; Supplier Footprint: SMD; JLCPCB Part Class: Extended Part; Datasheet: https://atta.szlcsc.com/upload/public/pdf/source/20211217/CCD3D517E355E8E0CC52ABD8D5784AD8.pdf; Supplier: LCSC; Convert to PCB: yes; Standard: -; Mounting Style: Surface Mount; Operating Temperature Range: -25℃~+85℃
R301-R304 = CMP-009-00158-3: Chip Resistor, 5.1 kOhms, +/-1 %, 63 mW, -55 to 155 degC, 0402; Power: 63mW; Tolerance: 1%; Max Operating Temperature: 155°C; Pins: 2; Min Operating Temperature: -55°C; Case/Package: 0402
U301 = CH342K: ESSOP-10-150mil USB Converters ROHS

## Sheet 4 memory.SchDoc
size A4; DocumentNumber: 4; SheetNumber: 6; SheetTotal: 12
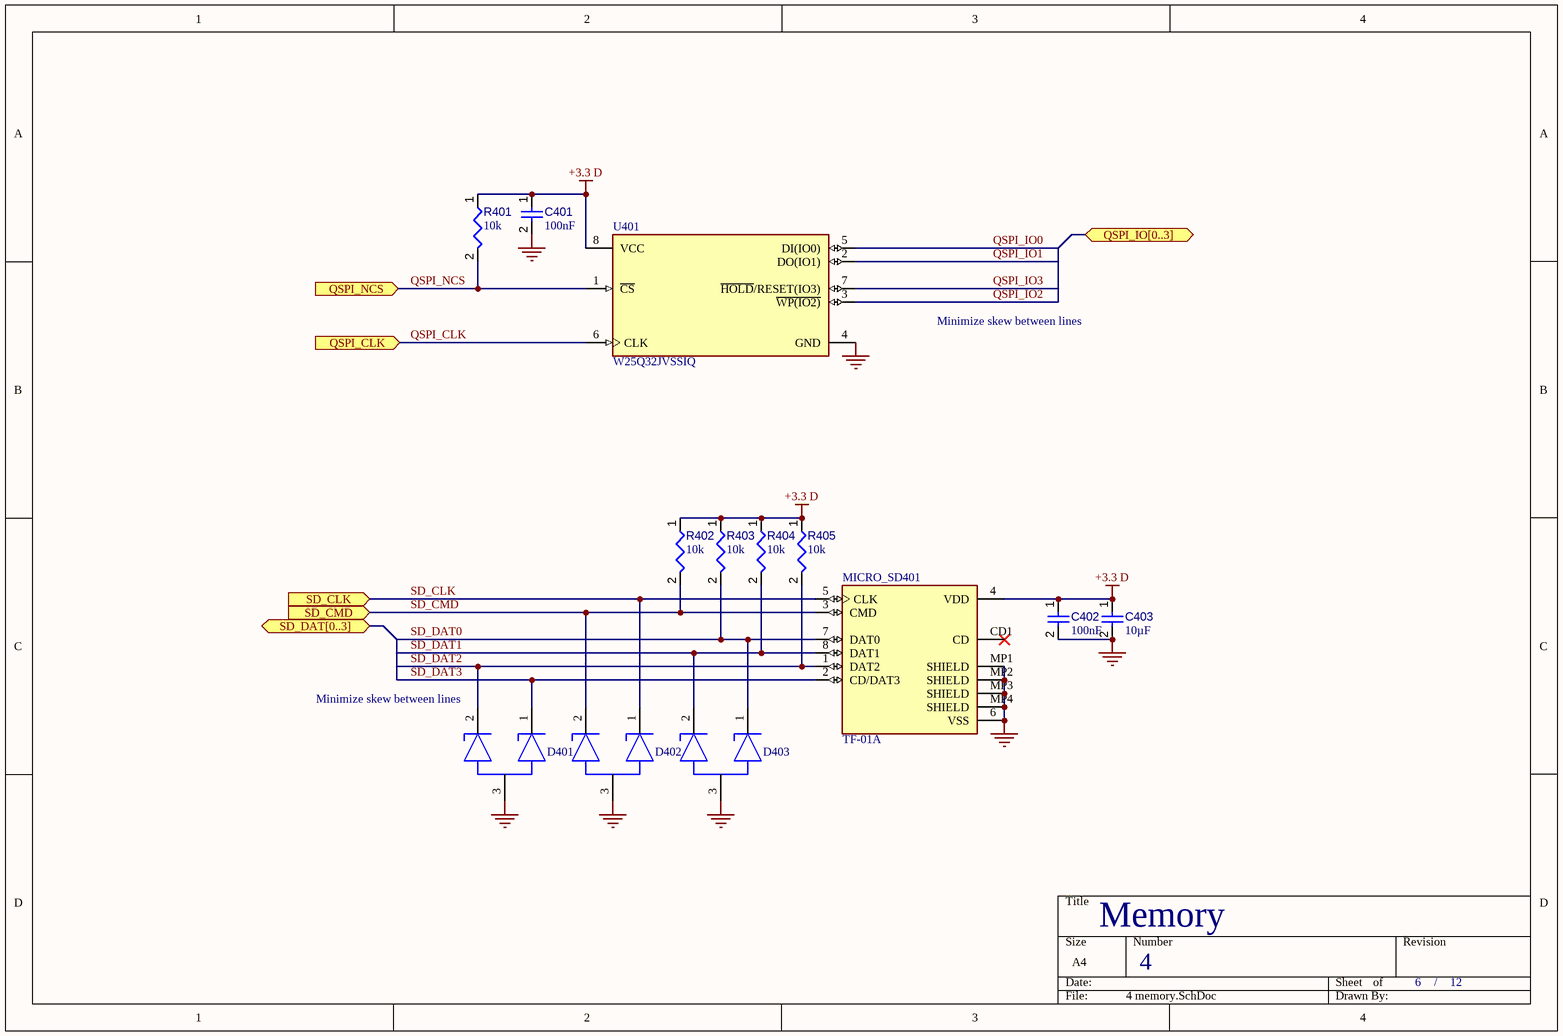
[diagram p5: 4 memory.SchDoc]

### Parts
C401  value 100nF  [CAPC0402(1005)60_L]  (hidden comment: Capacitor 100nF +/-20% 25V 0402)
C402  value 100nF  [CAPC0402(1005)60_L]  (hidden comment: Capacitor 100nF +/-20% 25V 0402)
C403  value 10µF  [CAPC0603(1608)100_L]  (hidden comment: Capacitor 10µF +/-20% 10V 0603)
D401  PESD3V3S2UT,215  [FP-SOT23-IPC_A]  (value not drawn)
D402  PESD3V3S2UT,215  [FP-SOT23-IPC_A]  (value not drawn)
D403  PESD3V3S2UT,215  [FP-SOT23-IPC_A]  (value not drawn)
MICRO_SD401  TF-01A  [TF-01A]
R401  value 10k  [RESC0402(1005)_L]  (hidden comment: Resistor 10K  +/-1 % 0402 63 mW)
R402  value 10k  [RESC0402(1005)_L]  (hidden comment: Resistor 10K  +/-1 % 0402 63 mW)
R403  value 10k  [RESC0402(1005)_L]  (hidden comment: Resistor 10K  +/-1 % 0402 63 mW)
R404  value 10k  [RESC0402(1005)_L]  (hidden comment: Resistor 10K  +/-1 % 0402 63 mW)
R405  value 10k  [RESC0402(1005)_L]  (hidden comment: Resistor 10K  +/-1 % 0402 63 mW)
U401  W25Q32JVSSIQ  [FP-SS-IPC_C]

### Ports
QSPI_CLK (in), QSPI_IO[0..3] (bidir), QSPI_NCS (in), SD_CLK (in), SD_CMD (in), SD_DAT[0..3] (bidir)

### Nets
+3.3 D: C401.1 C402.1 C403.1 MICRO_SD401.4(VDD) R401.1 R402.1 R403.1 R404.1 R405.1 U401.8(VCC)
GND: C401.2 C402.2 C403.2 D401.3 D402.3 D403.3 MICRO_SD401.6(VSS) MICRO_SD401.MP1(SHIELD) MICRO_SD401.MP2(SHIELD) MICRO_SD401.MP3(SHIELD) MICRO_SD401.MP4(SHIELD) U401.4(GND)
QSPI_CLK: U401.6(CLK) ; port QSPI_CLK
QSPI_IO0: U401.5(DI(IO0))
QSPI_IO1: U401.2(DO(IO1))
QSPI_IO2: U401.3(~{WP(IO2)})
QSPI_IO3: U401.7(~{HOLD}/RESET(IO3))
QSPI_NCS: R401.2 U401.1(~{CS}) ; port QSPI_NCS
SD_CLK: D402.1 MICRO_SD401.5(CLK) ; port SD_CLK
SD_CMD: D402.2 MICRO_SD401.3(CMD) R402.2 ; port SD_CMD
SD_DAT0: D403.1 MICRO_SD401.7(DAT0) R403.2
SD_DAT1: D403.2 MICRO_SD401.8(DAT1) R404.2
SD_DAT2: D401.2 MICRO_SD401.1(DAT2) R405.2
SD_DAT3: D401.1 MICRO_SD401.2(CD/DAT3)

Not connected (* = marked no-connect by the designer): MICRO_SD401 CD1(CD)*

### Notes on the sheet
- Minimize skew between lines
- (near D401) Minimize skew between lines
- Memory
- /

### Library data of the parts
C401 C402 = CMP-001-00065-4: as C121 on sheet 1 power; Max Operating Temperature: 85°C; Min Operating Temperature: -55°C; Pins: 2; Voltage Rating: 25V; Mounting Technology: SMT; Case/Package: 0402
C403 = CMP-001-00075-4: as C102 on sheet 1 power; Voltage Rating: 10V; Max Operating Temperature: 85°C; Pins: 2; Case/Package: 0603; Mounting Technology: SMT; Min Operating Temperature: -55°C
D401-D403 = CMP-14432-000008-1: TVS DIODE 3.3VWM 20VC TO236AB; RoHS Compliant: Yes
MICRO_SD401 = TF-01A: Standard Card Edge Connectors; MF: HRO Electronics Co., Ltd.; Price: None; Availability: Not in stock; MP: TF-01A; Package: Package; SnapEDA_Link: https://www.snapeda.com/parts/TF-01A/HRO+Electronics+Co.%252C+Ltd./view-part/?ref=snap; Check_prices: https://www.snapeda.com/parts/TF-01A/HRO+Electronics+Co.%252C+Ltd./view-part/?ref=eda; Value: *
R401-R405 = CMP-009-00149-3: as R103 on sheet 1 power; Min Operating Temperature: -55°C; Case/Package: 0402; Max Operating Temperature: 155°C; Pins: 2
U401 = CMP-2000-05006-2: IC FLASH 32M SPI 104MHZ 8SOIC; Manufacturer: Winbond; Obsolete Part: true; Access Time: 7ns; Nominal Supply Current: 8-20mA; Memory Size: 32Mbits; Max Supply Voltage: 3.6V; Min Supply Voltage: 2.7V; Standoff Height: 0.05mm; Interface: SPI,Other; Package: SS; Memory Type: FLASH; Ipc Land Pattern Name: SOIC127P790X195-8; Temperature Range High: +85°C; Temperature: -40°C to +85°C; Octopart: https://octopart.com/w25q32fvssig-winbond-23896462; Manufacturer Part Number: W25Q32JVSSIQ; Ambient Temperature Range Low: -40°C; Lead Free: Yes; Height: 2.16mm; Automotive: No; Device Class L2: Memory; Digikey Description: IC FLASH 32M SPI 104MHZ 8SOIC; RoHS: TRUE; Frequency: 104MHz; Ambient Temperature Range High: +85°C; ComponentLink2Description: Datasheet; Category: IC; Device Class L1: Integrated Circuits (ICs); Device Class L3: Flash; Temperature Range Low: -40°C; Footprint Url: http://www.winbond.com/resource-files/an0000009%20spiflash%20pcb%20layout%20guideline%20v2.0%2009252017.pdf?__locale=en; ComponentLink2URL: https://www.winbond.com/resource-files/w25q32fv%20revj%2006032016.pdf

## Sheet 5 led.SchDoc
size A4; DocumentNumber: 5; SheetNumber: 7; SheetTotal: 12
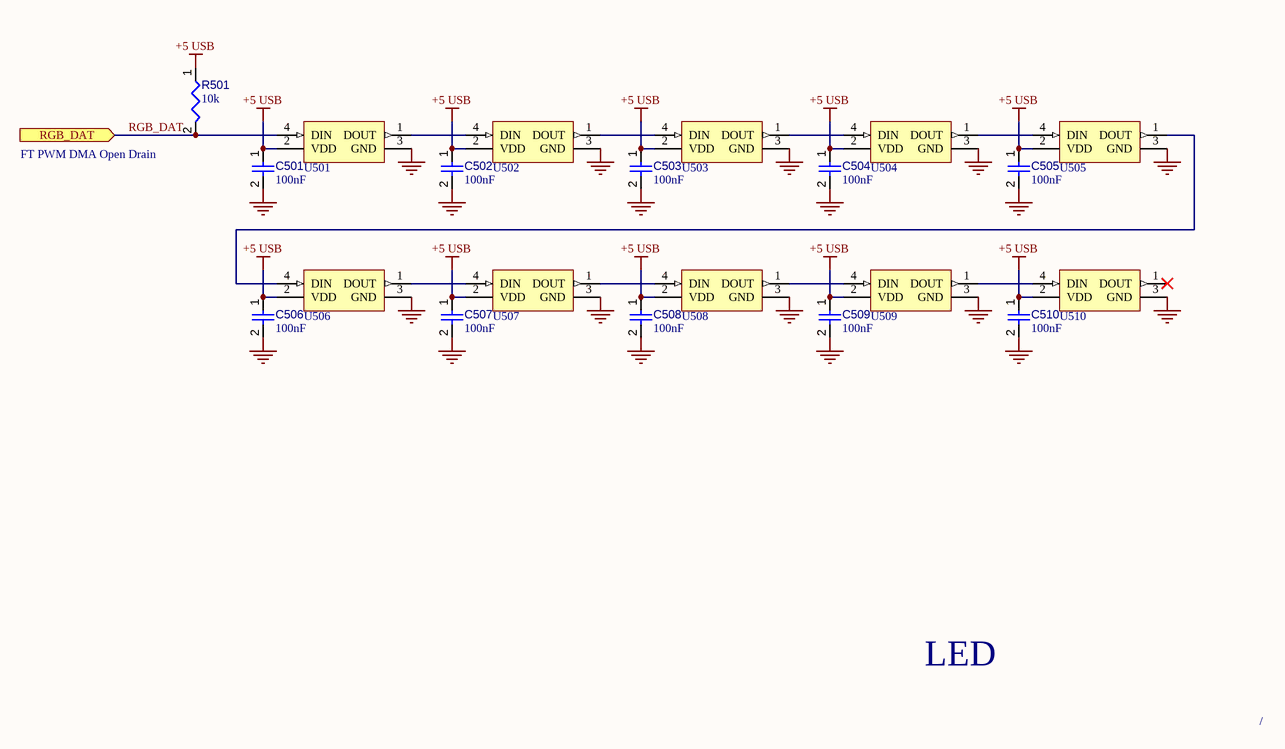
[diagram p6: 5 led.SchDoc]

### Parts
C501  value 100nF  [CAPC0402(1005)60_L]  (hidden comment: Capacitor 100nF +/-20% 25V 0402)
C502  value 100nF  [CAPC0402(1005)60_L]  (hidden comment: Capacitor 100nF +/-20% 25V 0402)
C503  value 100nF  [CAPC0402(1005)60_L]  (hidden comment: Capacitor 100nF +/-20% 25V 0402)
C504  value 100nF  [CAPC0402(1005)60_L]  (hidden comment: Capacitor 100nF +/-20% 25V 0402)
C505  value 100nF  [CAPC0402(1005)60_L]  (hidden comment: Capacitor 100nF +/-20% 25V 0402)
C506  value 100nF  [CAPC0402(1005)60_L]  (hidden comment: Capacitor 100nF +/-20% 25V 0402)
C507  value 100nF  [CAPC0402(1005)60_L]  (hidden comment: Capacitor 100nF +/-20% 25V 0402)
C508  value 100nF  [CAPC0402(1005)60_L]  (hidden comment: Capacitor 100nF +/-20% 25V 0402)
C509  value 100nF  [CAPC0402(1005)60_L]  (hidden comment: Capacitor 100nF +/-20% 25V 0402)
C510  value 100nF  [CAPC0402(1005)60_L]  (hidden comment: Capacitor 100nF +/-20% 25V 0402)
R501  value 10k  [RESC0402(1005)_L]  (hidden comment: Resistor 10K  +/-1 % 0402 63 mW)
U501  WS2812B 1615  [WS2812B 1615]  (value not drawn)
U502  WS2812B 1615  [WS2812B 1615]  (value not drawn)
U503  WS2812B 1615  [WS2812B 1615]  (value not drawn)
U504  WS2812B 1615  [WS2812B 1615]  (value not drawn)
U505  WS2812B 1615  [WS2812B 1615]  (value not drawn)
U506  WS2812B 1615  [WS2812B 1615]  (value not drawn)
U507  WS2812B 1615  [WS2812B 1615]  (value not drawn)
U508  WS2812B 1615  [WS2812B 1615]  (value not drawn)
U509  WS2812B 1615  [WS2812B 1615]  (value not drawn)
U510  WS2812B 1615  [WS2812B 1615]  (value not drawn)

### Ports
RGB_DAT (in)

### Nets
+5 USB: C501.1 C502.1 C503.1 C504.1 C505.1 C506.1 C507.1 C508.1 C509.1 C510.1 R501.1 U501.2(VDD) U502.2(VDD) U503.2(VDD) U504.2(VDD) U505.2(VDD) U506.2(VDD) U507.2(VDD) U508.2(VDD) U509.2(VDD) U510.2(VDD)
GND: C501.2 C502.2 C503.2 C504.2 C505.2 C506.2 C507.2 C508.2 C509.2 C510.2 U501.3(GND) U502.3(GND) U503.3(GND) U504.3(GND) U505.3(GND) U506.3(GND) U507.3(GND) U508.3(GND) U509.3(GND) U510.3(GND)
RGB_DAT: R501.2 U501.4(DIN) ; port RGB_DAT
NetU501_1: U501.1(DOUT) U502.4(DIN)
NetU502_1: U502.1(DOUT) U503.4(DIN)
NetU503_1: U503.1(DOUT) U504.4(DIN)
NetU504_1: U504.1(DOUT) U505.4(DIN)
NetU505_1: U505.1(DOUT) U506.4(DIN)
NetU506_1: U506.1(DOUT) U507.4(DIN)
NetU507_1: U507.1(DOUT) U508.4(DIN)
NetU508_1: U508.1(DOUT) U509.4(DIN)
NetU509_1: U509.1(DOUT) U510.4(DIN)

Not connected (* = marked no-connect by the designer): U510 1(DOUT)*

### Notes on the sheet
- FT PWM DMA Open Drain
- LED
- /

### Library data of the parts
C501-C510 = CMP-001-00065-4: as C121 on sheet 1 power; Max Operating Temperature: 85°C; Min Operating Temperature: -55°C; Pins: 2; Voltage Rating: 25V; Mounting Technology: SMT; Case/Package: 0402
R501 = CMP-009-00149-3: as R103 on sheet 1 power; Min Operating Temperature: -55°C; Case/Package: 0402; Max Operating Temperature: 155°C; Pins: 2

## Sheet 6 cell amplifier.SchDoc
size A4; DocumentNumber: 6; SheetNumber: 8; SheetTotal: 12
Used 6 times, as channels Amplifiers1, Amplifiers2, Amplifiers3, Amplifiers4, Amplifiers5, Amplifiers6. Parts and nets are listed once, with the designators drawn on the sheet.
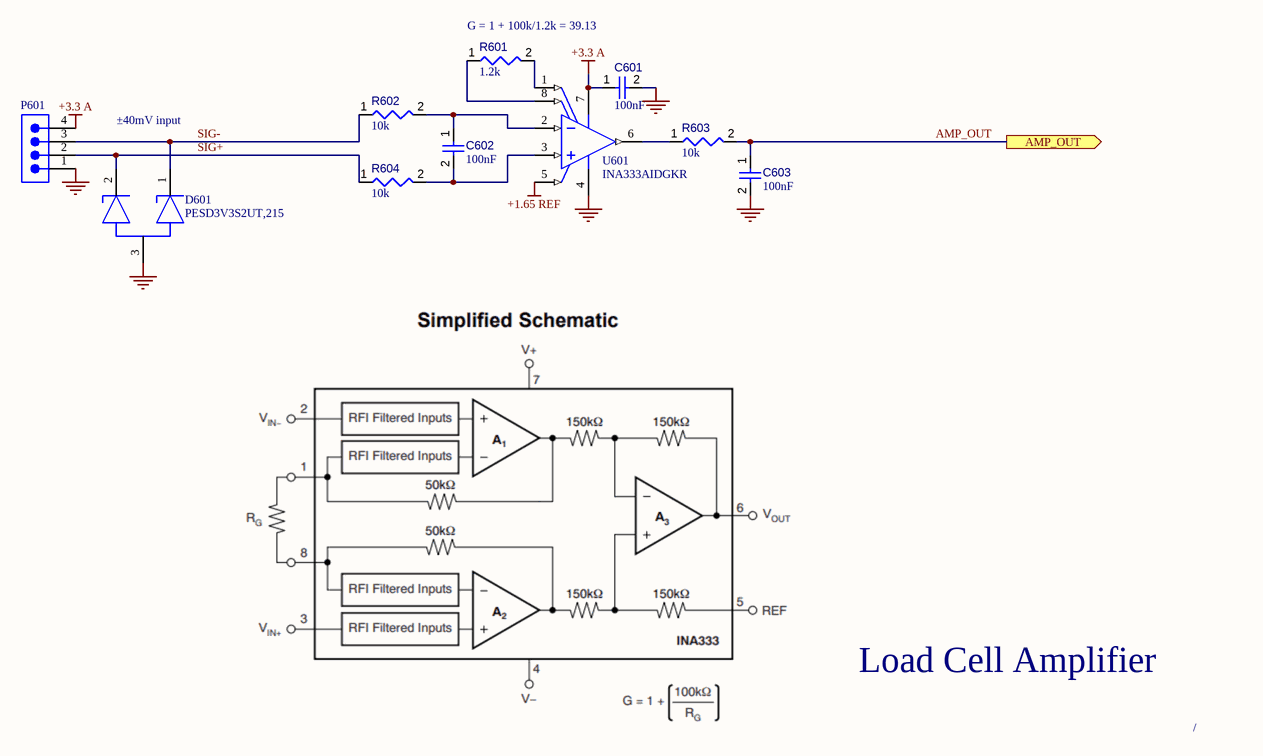
[diagram p7: 6 cell amplifier.SchDoc]

### Parts
C601  value 100nF  [CAPC0402(1005)60_L]  (hidden comment: Capacitor 100nF +/-20% 25V 0402)
C602  value 100nF  [CAPC0402(1005)60_L]  (hidden comment: Capacitor 100nF +/-20% 25V 0402)
C603  value 100nF  [CAPC0402(1005)60_L]  (hidden comment: Capacitor 100nF +/-20% 25V 0402)
D601  PESD3V3S2UT,215  [FP-SOT23-IPC_A]
P601  61300411121  [61300411121]  (value not drawn)
R601  value 1.2k  [RESC0402(1005)_L]  (hidden comment: Resistor 1K2 +/-1 % 0402 63 mW)
R602  value 10k  [RESC0402(1005)_L]  (hidden comment: Resistor 10K  +/-1 % 0402 63 mW)
R603  value 10k  [RESC0402(1005)_L]  (hidden comment: Resistor 10K  +/-1 % 0402 63 mW)
R604  value 10k  [RESC0402(1005)_L]  (hidden comment: Resistor 10K  +/-1 % 0402 63 mW)
U601  INA333AIDGKR  [DGK0008A_L]

### Ports
AMP_OUT (out)

### Nets
+1.65 REF: U601.5(REF)
+3.3 A: C601.1 P601.4 U601.7(V+)
GND: C601.2 C603.2 D601.3 P601.1 U601.4(V-)
AMP_OUT: C603.1 R603.2 ; port AMP_OUT
SIG+: D601.2 P601.2 R604.1
SIG-: D601.1 P601.3 R602.1
NetC602_1: C602.1 R602.2 U601.2(VIN-)
NetC602_2: C602.2 R604.2 U601.3(VIN+)
NetR601_1: R601.1 U601.8(RG)
NetR601_2: R601.2 U601.1(RG)
NetR603_1: R603.1 U601.6(VOUT)

### Channels
Amplifiers1: designators end in _Amplifiers1; ports AMP_OUT=AMP_OUT_Amplifiers1
Amplifiers2: designators end in _Amplifiers2; ports AMP_OUT=AMP_OUT_Amplifiers2
Amplifiers3: designators end in _Amplifiers3; ports AMP_OUT=AMP_OUT_Amplifiers3
Amplifiers4: designators end in _Amplifiers4; ports AMP_OUT=AMP_OUT_Amplifiers4
Amplifiers5: designators end in _Amplifiers5; ports AMP_OUT=AMP_OUT_Amplifiers5
Amplifiers6: designators end in _Amplifiers6; ports AMP_OUT=AMP_OUT_Amplifiers6

### Notes on the sheet
- (near R601) G = 1 + 100k/1.2k = 39.13
- ±40mV input
- Load Cell Amplifier
- /

### Library data of the parts
C601-C603 = CMP-001-00065-4: as C121 on sheet 1 power; Max Operating Temperature: 85°C; Min Operating Temperature: -55°C; Pins: 2; Voltage Rating: 25V; Mounting Technology: SMT; Case/Package: 0402
D601 = CMP-14432-000008-1: TVS DIODE 3.3VWM 20VC TO236AB; RoHS Compliant: Yes
P601 = CMP-1502-01064-3: as P201 on sheet 2 main mcu; Contact Plating: Gold; Height: 8.89mm; Lead Pitch: 2.54mm; Lead Free: Lead Free; Contact Mating Length: 5.9944mm; Number of Rows: 1; Termination: Solder; Packaging: Bulk; REACH SVHC: Unknown; Min Operating Temperature: -40°C; RoHS: Compliant; Number of Contacts: 4; Voltage Rating: 250V; Color: Black; Max Operating Temperature: 105°C; Contact Material: Copper; Mount: Through Hole; Orientation: Vertical; Number of Pins: 4
R601 = CMP-009-00157-3: as R104 on sheet 1 power; Case/Package: 0402; Pins: 2; Min Operating Temperature: -55°C; Max Operating Temperature: 155°C
R602-R604 = CMP-009-00149-3: as R103 on sheet 1 power; Min Operating Temperature: -55°C; Case/Package: 0402; Max Operating Temperature: 155°C; Pins: 2
U601 = CMP-0944-00088-2: Low Power, Precision Instrumentation Amplifier, -40 to 125 degC, 8-pin SOP (DGK8), Green (RoHS & no Sb/Br); Manufacturer: Texas Instruments; Input Offset Drift (+/-)(Max)(uV/Degrees Celsius): 0.1; Vs(Max)(V): 5.5; Input Bias Current (+/-)(Max)(nA): 0.2; Output Offset (+/-)(Max)(uV): 75/G; CMRR(Min)(dB): 100; Noise at 1kHz(Typ)(nV/rt(Hz)): 50; Output Offset Drift (+/-)(Max)(uV/Degrees Celsius): 0.5/G; Vs(Min)(V): 1.8; Quiescent Current (+/-)(Typ)(mA): 0.05; Gain(V/V): 1 to 1000; SubFamily: Single Supply; Number of Channels: 1; Input Offset (+/-)(Max)(uV): 25; Code_JEDEC: MO-187; Eco-Plan: Green (RoHS & no Sb/Br); ComponentLink2URL: http://www.ti.com/general/docs/lit/getliterature.tsp?genericPartNumber=INA333&fileType=pdf; Mounting Technology: Surface Mount; PartNumber: INA333AIDGKR; ComponentLink3URL: http://www.ti.com/litv/pdf/mpds028d; ComponentLink1URL: http://www.ti.com/; DatasheetVersion: SBOS445B; ComponentLink2Description: Datasheet; PackageVersion: 4073329/E, 05/2006; PackageReference: DGK0008A; ComponentLink3Description: Package Specification; PackageDescription: 8-Pin Thin Small Outline, Body 3 x 3 mm, Pitch 0.65 mm; ComponentLink1Description: Manufacturer URL

## Sheet 7 esc.SchDoc
size A4; DocumentNumber: 7; SheetNumber: 9; SheetTotal: 12
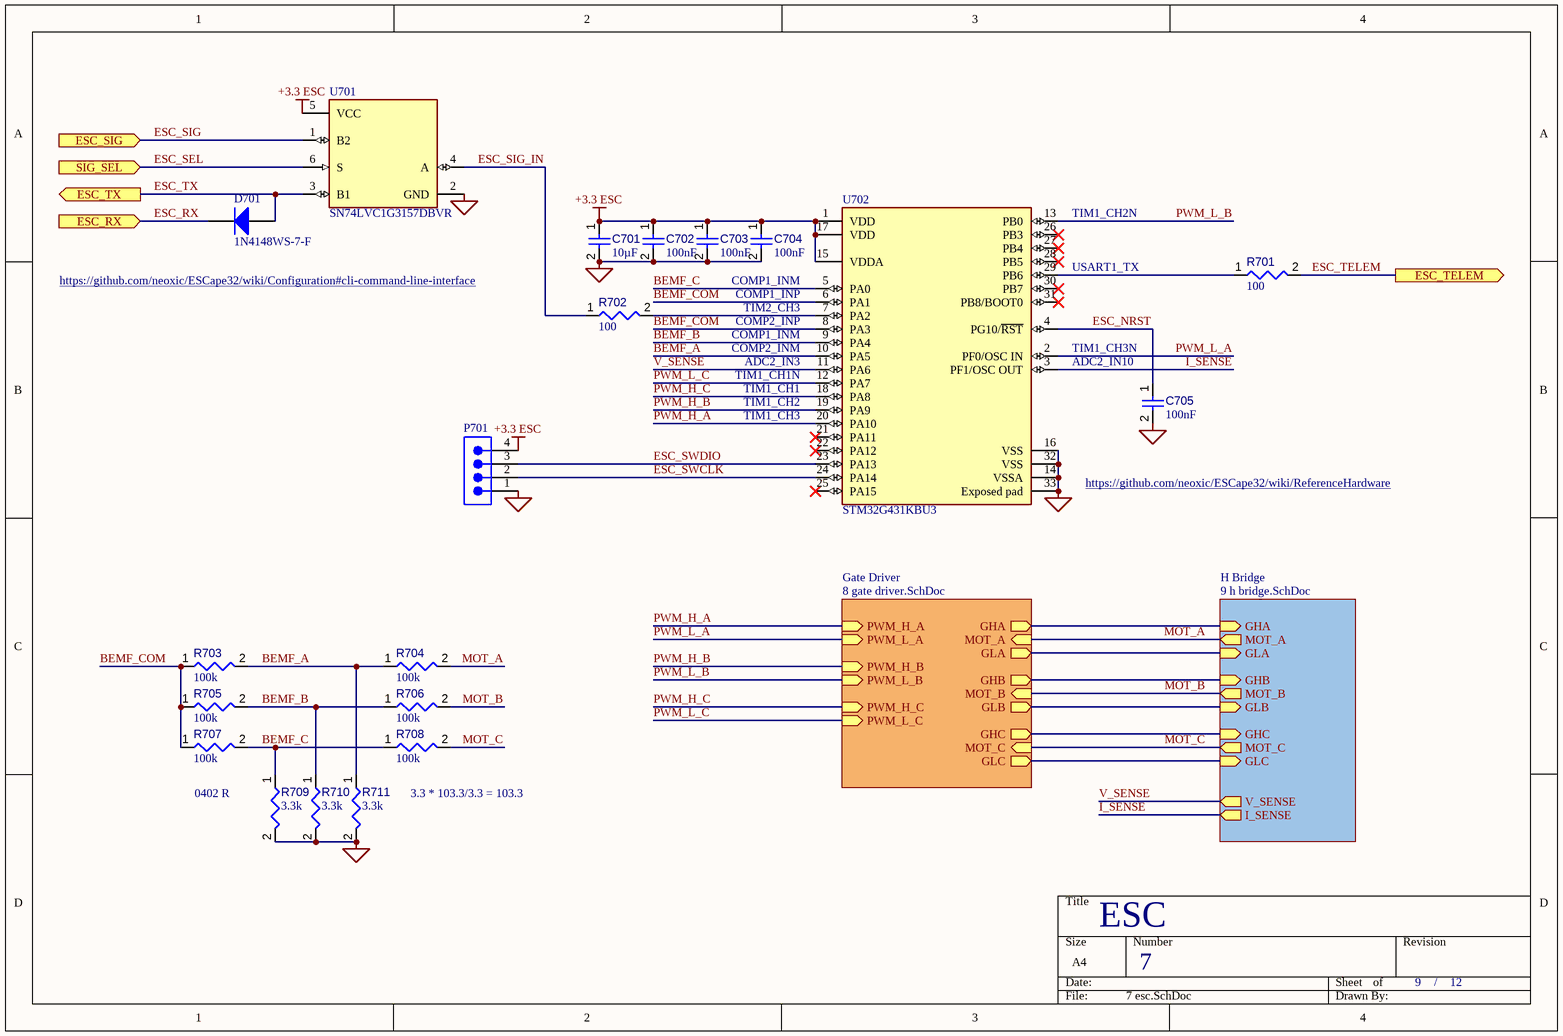
[diagram p8: 7 esc.SchDoc]

### Parts
C701  value 10µF  [CAPC0603(1608)100_L]  (hidden comment: Capacitor 10µF +/-20% 10V 0603)
C702  value 100nF  [CAPC0402(1005)60_L]  (hidden comment: Capacitor 100nF +/-20% 25V 0402)
C703  value 100nF  [CAPC0402(1005)60_L]  (hidden comment: Capacitor 100nF +/-20% 25V 0402)
C704  value 100nF  [CAPC0402(1005)60_L]  (hidden comment: Capacitor 100nF +/-20% 25V 0402)
C705  value 100nF  [CAPC0402(1005)60_L]  (hidden comment: Capacitor 100nF +/-20% 25V 0402)
D701  1N4148WS-7-F  [DIOD-SOD323-2-A_V]
P701  61300411121  [61300411121]  (value not drawn)
R701  value 100  [RESC0402(1005)_L]  (hidden comment: Resistor 100R +/-1 % 0402 63 mW)
R702  value 100  [RESC0402(1005)_L]  (hidden comment: Resistor 100R +/-1 % 0402 63 mW)
R703  value 100k  [RESC0402(1005)_L]  (hidden comment: Resistor 100K +/-1 % 0402 63 mW)
R704  value 100k  [RESC0402(1005)_L]  (hidden comment: Resistor 100K +/-1 % 0402 63 mW)
R705  value 100k  [RESC0402(1005)_L]  (hidden comment: Resistor 100K +/-1 % 0402 63 mW)
R706  value 100k  [RESC0402(1005)_L]  (hidden comment: Resistor 100K +/-1 % 0402 63 mW)
R707  value 100k  [RESC0402(1005)_L]  (hidden comment: Resistor 100K +/-1 % 0402 63 mW)
R708  value 100k  [RESC0402(1005)_L]  (hidden comment: Resistor 100K +/-1 % 0402 63 mW)
R709  value 3.3k  [RESC0402(1005)_L]  (hidden comment: Resistor 3K3 +/-1 % 0402 63 mW)
R710  value 3.3k  [RESC0402(1005)_L]  (hidden comment: Resistor 3K3 +/-1 % 0402 63 mW)
R711  value 3.3k  [RESC0402(1005)_L]  (hidden comment: Resistor 3K3 +/-1 % 0402 63 mW)
U701  SN74LVC1G3157DBVR  [FP-DBV0006A-IPC_C]
U702  STM32G431KBU3  [FP-UFQFPN32-A0B8-MFG]

### Sub-sheets
Gate Driver = 8 gate driver.SchDoc: MOT_A (in), MOT_B (in), MOT_C (in), GHA (out), GLA (out), GHB (out), GLB (out), GHC (out), GLC (out), PWM_H_A (in), PWM_L_A (in), PWM_H_B (in), PWM_H_C (in), PWM_L_B (in), PWM_L_C (in)
H Bridge = 9 h bridge.SchDoc: I_SENSE (out), V_SENSE (out), GHA (in), MOT_A (out), GLA (in), GHB (in), MOT_B (out), GLB (in), GHC (in), MOT_C (out), GLC (in)

### Ports
ESC_RX (in), ESC_SIG (in), ESC_TELEM (out), ESC_TX (out), SIG_SEL (in)

### Nets
+3.3 ESC: C701.1 C702.1 C703.1 C704.1 P701.4 U701.5(VCC) U702.1(VDD) U702.15(VDDA) U702.17(VDD)
PGND: C701.2 C702.2 C703.2 C704.2 C705.2 P701.1 R709.2 R710.2 R711.2 U701.2(GND) U702.14(VSSA) U702.16(VSS) U702.32(VSS) U702.33(Exposed_pad)
BEMF_A: R703.2 R704.1 R711.1 U702.10(PA5)
BEMF_B: R705.2 R706.1 R710.1 U702.9(PA4)
BEMF_C: R707.2 R708.1 R709.1 U702.5(PA0)
BEMF_COM: R703.1 R705.1 R707.1 U702.6(PA1) U702.8(PA3)
ESC_NRST: C705.1 U702.4(PG10/~{RST})
ESC_RX: D701.2(K) ; port ESC_RX
ESC_SEL: U701.6(S) ; port SIG_SEL
ESC_SIG: U701.1(B2) ; port ESC_SIG
ESC_SIG_IN: R702.1 U701.4(A)
ESC_SWCLK: P701.2 U702.24(PA14)
ESC_SWDIO: P701.3 U702.23(PA13)
ESC_TELEM: R701.2 ; port ESC_TELEM
ESC_TX: D701.1(A) U701.3(B1) ; port ESC_TX
GHA: sheet H Bridge/GHA, sheet Gate Driver/GHA
GHB: sheet H Bridge/GHB, sheet Gate Driver/GHB
GHC: sheet H Bridge/GHC, sheet Gate Driver/GHC
GLA: sheet H Bridge/GLA, sheet Gate Driver/GLA
GLB: sheet H Bridge/GLB, sheet Gate Driver/GLB
GLC: sheet H Bridge/GLC, sheet Gate Driver/GLC
I_SENSE: U702.3(PF1/OSC_OUT) ; sheet H Bridge/I_SENSE
MOT_A: R704.2 ; sheet H Bridge/MOT_A, sheet Gate Driver/MOT_A
MOT_B: R706.2 ; sheet H Bridge/MOT_B, sheet Gate Driver/MOT_B
MOT_C: R708.2 ; sheet H Bridge/MOT_C, sheet Gate Driver/MOT_C
PWM_H_A: U702.20(PA10) ; sheet Gate Driver/PWM_H_A
PWM_H_B: U702.19(PA9) ; sheet Gate Driver/PWM_H_B
PWM_H_C: U702.18(PA8) ; sheet Gate Driver/PWM_H_C
PWM_L_A: U702.2(PF0/OSC_IN) ; sheet Gate Driver/PWM_L_A
PWM_L_B: U702.13(PB0) ; sheet Gate Driver/PWM_L_B
PWM_L_C: U702.12(PA7) ; sheet Gate Driver/PWM_L_C
V_SENSE: U702.11(PA6) ; sheet H Bridge/V_SENSE
NetR701_1: R701.1 U702.29(PB6)
NetR702_2: R702.2 U702.7(PA2)

Not connected (* = marked no-connect by the designer): U702 21(PA11)* 22(PA12)* 25(PA15)* 26(PB3)* 27(PB4)* 28(PB5)* 30(PB7)* 31(PB8/BOOT0)*

### Notes on the sheet
- (near U702) TIM1_CH2N
- https://github.com/neoxic/ESCape32/wiki/Configuration#cli-command-line-interface
- COMP1_INM
- COMP1_INP
- TIM2_CH3
- (near U702) USART1_TX
- (near U702) TIM1_CH1N
- (near U702) ADC2_IN3
- (near U702) COMP1_INM
- (near U702) COMP2_INM
- (near U702) COMP2_INP
- TIM1_CH3N
- ADC2_IN10
- (near U702) TIM1_CH1
- (near U702) TIM1_CH2
- (near U702) TIM1_CH3
- https://github.com/neoxic/ESCape32/wiki/ReferenceHardware
- 0402 R
- 3.3 * 103.3/3.3 = 103.3
- ESC
- /

### Library data of the parts
C701 = CMP-001-00075-4: as C102 on sheet 1 power; Voltage Rating: 10V; Max Operating Temperature: 85°C; Pins: 2; Case/Package: 0603; Mounting Technology: SMT; Min Operating Temperature: -55°C
C702-C705 = CMP-001-00065-4: as C121 on sheet 1 power; Max Operating Temperature: 85°C; Min Operating Temperature: -55°C; Pins: 2; Voltage Rating: 25V; Mounting Technology: SMT; Case/Package: 0402
D701 = CMP-1667-00004-1: Fast Switching Diode, 75 V, 0.3 A, -65 to 150 degC, 2-Pin SOD323, RoHS, Tape and Reel; DatasheetVersion: Rev. 25-2, 03/2016; PackageDescription: 2-Pin Small Outline Diode, Body 1.7 x 1.3 mm; ComponentLink2Description: Datasheet; ComponentLink1URL: http://www.diodes.com/; PackageReference: SOD323-2; ComponentLink2URL: http://www.diodes.com/datasheets/ds30097.pdf; ComponentLink1Description: Manufacturer URL
P701 = CMP-1502-01064-3: as P201 on sheet 2 main mcu; Contact Plating: Gold; Height: 8.89mm; Lead Pitch: 2.54mm; Lead Free: Lead Free; Contact Mating Length: 5.9944mm; Number of Rows: 1; Termination: Solder; Packaging: Bulk; REACH SVHC: Unknown; Min Operating Temperature: -40°C; RoHS: Compliant; Number of Contacts: 4; Voltage Rating: 250V; Color: Black; Max Operating Temperature: 105°C; Contact Material: Copper; Mount: Through Hole; Orientation: Vertical; Number of Pins: 4
R701 R702 = CMP-009-00167-3: Chip Resistor, 100 Ohms, +/-1 %, 63 mW, -55 to 155 degC, 0402; Power: 63mW; Tolerance: 1%; Min Operating Temperature: -55°C; Case/Package: 0402; Pins: 2; Max Operating Temperature: 155°C
R703-R708 = CMP-009-00168-3: as R101 on sheet 1 power; Max Operating Temperature: 155°C; Min Operating Temperature: -55°C; Pins: 2; Case/Package: 0402
R709-R711 = CMP-009-00145-3: Chip Resistor, 3.3 kOhms, +/-1 %, 63 mW, -55 to 155 degC, 0402; Tolerance: 1%; Power: 63mW; Case/Package: 0402; Min Operating Temperature: -55°C; Max Operating Temperature: 155°C; Pins: 2
U701 = CMP-0859-00203-4: IC SWITCH SPDT SOT23-6; Number of Outputs: 2; Propagation Delay: 300ps; On-State Resistance: 15R; Nominal Supply Current: 10uA; Number of Inputs: 1; Max Supply Voltage: 5.5V; Supply Type: Single; Low Level Output Current: 128mA; Bandwidth: 300MHz; Turn-Off Delay Time: 3.8ns; Turn-On Delay Time: 5.7ns; Operating Supply Current: 1uA; Min Supply Voltage: 1.65V; Polarity: Non-Inverting; Height: 1.3mm; Number of Bits: 1; Case/Package: SOT-23; REACH SVHC: No SVHC; High Level Output Current: 128mA; Weight: 0.000229oz; Max Supply Current: 10uA; Width: 1.75mm; Radiation Hardening: No; Supply Current: 10uA; Length: 3.05mm; Max Operating Temperature: 125°C; Min Operating Temperature: -40°C; Package Quantity: 3000; Number of Pins: 6; Termination: SMD/SMT; Series: 74LVC; Packaging: Tape and Reel; Lead Free: Lead Free; Contact Plating: Gold; Mount: Surface Mount; RoHS Compliant: Yes; Number of Channels: 1; Throw Configuration: SPDT
U702 = CMP-12105-000119-1: IC MCU 32BIT 128KB FLSH 32UFQFPN; RoHS Compliant: Yes